# EAGLE design untitled (EAGLE 9.5.2)
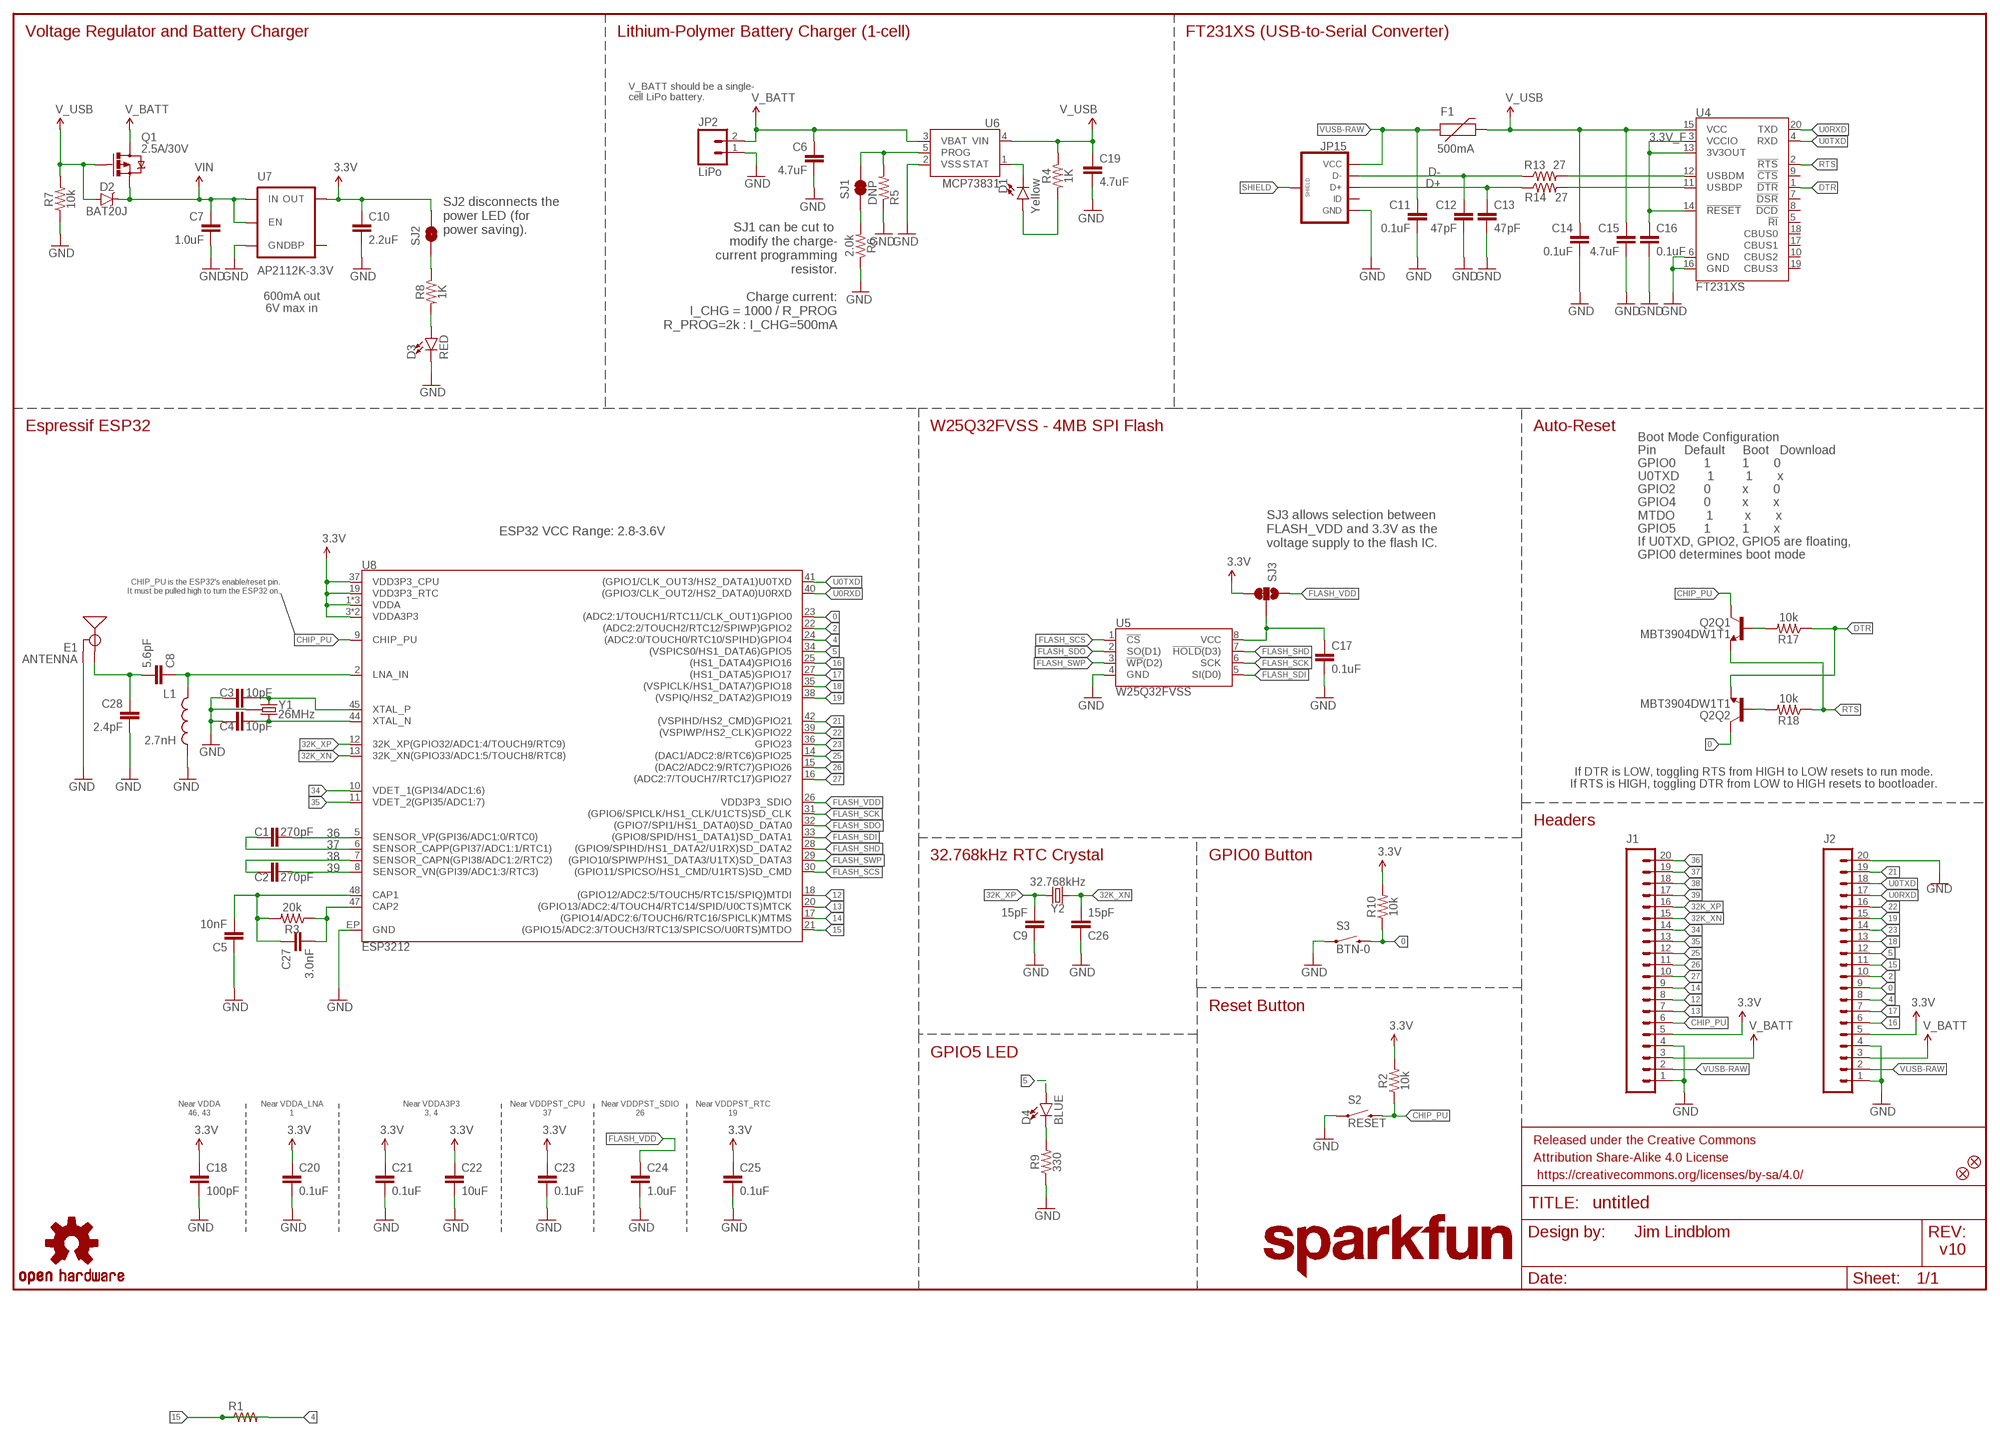
[diagram p0: schematic, sheet 1]

## Parts
C1  270pF  270PF-50V-5%(0603)  [0603]
C2  270pF  270PF-50V-5%(0603)  [0603]
C3  10pF  10PF-0603-50V-5%  [0603]
C4  10pF  10PF-0603-50V-5%  [0603]
C5  10nF  10NF-0603-50V-10%  [0603]
C6  4.7uF  4.7UF0603  [0603]
C7  1.0uF  1.0UF-0805-25V-(+80/-20%)  [0805]
C8  5.6pF  5.6PF-50V-5%(0603)  [0603]
C9  15pF  15PF-0603-50V-5%  [0603]
C10  2.2uF  2.2UF-0603-10V-20%  [0603]
C11  0.1uF  0.1UF-0603-25V-(+80/-20%)  [0603]
C12  47pF  47PF-0603-50V-5%  [0603]
C13  47pF  47PF-0603-50V-5%  [0603]
C14  0.1uF  0.1UF-0603-25V-(+80/-20%)  [0603]
C15  4.7uF  4.7UF-6.3V-10%(0603)0603  [0603-CAP]
C16  0.1uF  0.1UF-0603-25V-(+80/-20%)  [0603]
C17  0.1uF  0.1UF-0603-25V-(+80/-20%)  [0603]
C18  100pF  100PF-0603-50V-5%  [0603]
C19  4.7uF  4.7UF0603  [0603]
C20  0.1uF  0.1UF-0603-25V-(+80/-20%)  [0603]
C21  0.1uF  0.1UF-0603-25V-(+80/-20%)  [0603]
C22  10uF  10UF-0603-6.3V-20%  [0603]
C23  0.1uF  0.1UF-0603-25V-(+80/-20%)  [0603]
C24  1.0uF  1.0UF-0603-16V-10%  [0603]
C25  0.1uF  0.1UF-0603-25V-(+80/-20%)  [0603]
C26  15pF  15PF-0603-50V-5%  [0603]
C27  3.0nF  3.0NF-0603-50V-5%  [0603]
C28  2.4pF  2.4PF-0603-50V-5%  [0603]
D1  Yellow  LED-YELLOW0603  [LED-0603]
D2  BAT20J  DIODE-SCHOTTKY-BAT20J  [SOD-323]
D3  RED  LED-RED0603  [LED-0603]
D4  BLUE  LED-BLUE0603  [LED-0603]
E1  ANTENNA  ANTENNATRACE-TUNED  [TRACE_ANTENNA_2.4GHZ_25.7MM_TUNED]
F1  500mA  PTCSMD  [PTC-1206]
FD1  FIDUCIALUFIDUCIAL  [MICRO-FIDUCIAL]
FD2  FIDUCIALUFIDUCIAL  [MICRO-FIDUCIAL]
FRAME2  FRAME-LEDGER  [CREATIVE_COMMONS]
J1  M20NOSILK  [1X20_NOSILK]
J2  M20NOSILK  [1X20_NOSILK]
JP2  LiPo  M02JST-PTH-2  [JST-2-PTH]
JP15  USB_MICROB_PLUGCONN-11752  [USB-B-MICRO-SMD_V03]
L1  2.7nH  INDUCTOR0603  [0603]
LOGO1  SFE_LOGO_NAME.2_INCH  [SFE_LOGO_NAME_.2]
LOGO2  OSHW-LOGOMINI  [OSHW-LOGO-MINI]
LOGO3  SFE_LOGO_NAME.2_INCH  [SFE_LOGO_NAME_.2]
Q1  2.5A/30V  MOSFET-PCHANNELDMG2307L  [SOT23-3]
Q2  MBT3904DW1T1  [SC70-6]
R1  R-US_M0805  [M0805]
R2  10k  10KOHM-1/10W-1%(0603)0603  [0603]
R3  20k  20KOHM-0603-1/10W-1%  [0603]
R4  1K  1KOHM-1/10W-1%(0603)  [0603]
R5  DNP  RESISTORPTH-1/6W  [1/6W-RES]
R6  2.0k  2.0KOHM1/10W5%(0603)  [0603]
R7  10k  10KOHM-0603-1/10W-1%  [0603]
R8  1K  1KOHM-1/10W-1%(0603)  [0603]
R9  330  330OHM1/10W1%(0603)  [0603]
R10  10k  10KOHM-1/10W-1%(0603)0603  [0603]
R13  27  27OHM1/10W1%(0603)0603-RES  [0603]
R14  27  27OHM1/10W1%(0603)0603-RES  [0603]
R17  10k  10KOHM-0603-1/10W-1%  [0603]
R18  10k  10KOHM-0603-1/10W-1%  [0603]
S2  RESET  SWITCH-MOMENTARY-2SMD-4.6X2.8MM  [TACTILE_SWITCH_SMD_4.6X2.8MM]
S3  BTN-0  SWITCH-MOMENTARY-2SMD-4.6X2.8MM  [TACTILE_SWITCH_SMD_4.6X2.8MM]
SJ1  JUMPER-PAD-2-NC_BY_TRACE  [PAD-JUMPER-2-NC_BY_TRACE_YES_SILK]
SJ2  JUMPER-PAD-2-NC_BY_TRACE  [PAD-JUMPER-2-NC_BY_TRACE_YES_SILK]
SJ3  JUMPER-PAD-3-2OF3_NC_BY_TRACE_SMALL  [PAD-JUMPER-3-2OF3_NC_BY_TRACE_YES_SILK_FULL_BOX]
U4  FT231XS  [SSOP20_L]
U5  W25Q32FVSS  [SOIC-8]
U6  MCP73831  [SOT23-5]
U7  AP2112K-3.3V  V_REG_LDOSMD  [SOT23-5]
U8  ESP3212  [QFN48-0.4MM]
Y1  26MHz  CRYSTAL-GROUNDED3.2X2.5  [CRYSTAL-SMD-3.2X2.5]
Y2  32.768kHz  CRYSTAL-32.768KHZSMD-3.2X1.5  [CRYSTAL-SMD-3.2X1.5MM]

## Nets
0: J2.9 Q2.6(Q2:C) R10.1 S3.3 S3.4 U8.23((ADC2:1/TOUCH1/RTC11/CLK_OUT1)GPIO0)
2: J2.10 U8.22((ADC2:2/TOUCH2/RTC12/SPIWP)GPIO2)
3.3V: C10.1 C18.1 C20.1 C21.1 C22.1 C23.1 C25.1 J1.5 J2.5 R2.2 R10.2 SJ2.2 SJ3.3 U7.5(OUT) U8.1(VDDA) U8.3(VDDA3P3) U8.4(VDDA3P3) U8.19(VDD3P3_RTC) U8.37(VDD3P3_CPU) U8.43(VDDA) U8.46(VDDA)
3.3V_F: C16.1 U4.3(VCCIO) U4.13(3V3OUT) U4.14(!RESET)
4: J2.8 U8.24((ADC2:0/TOUCH0/RTC10/SPIHD)GPIO4)
5: D4.A J2.12 U8.34((VSPICS0/HS1_DATA6)GPIO5)
12: J1.8 U8.18((GPIO12/ADC2:5/TOUCH5/RTC15/SPIQ)MTDI)
13: J1.7 U8.20((GPIO13/ADC2:4/TOUCH4/RTC14/SPID/U0CTS)MTCK)
14: J1.9 U8.17((GPIO14/ADC2:6/TOUCH6/RTC16/SPICLK)MTMS)
15: J2.11 U8.21((GPIO15/ADC2:3/TOUCH3/RTC13/SPICSO/U0RTS)MTDO)
16: J2.6 U8.25((HS1_DATA4)GPIO16)
17: J2.7 U8.27((HS1_DATA5)GPIO17)
18: J2.13 U8.35((VSPICLK/HS1_DATA7)GPIO18)
19: J2.15 U8.38((VSPIQ/HS2_DATA2)GPIO19)
21: J2.19 U8.42((VSPIHD/HS2_CMD)GPIO21)
22: J2.16 U8.39((VSPIWP/HS2_CLK)GPIO22)
23: J2.14 U8.36(GPIO23)
25: J1.12 U8.14((DAC1/ADC2:8/RTC6)GPIO25)
26: J1.11 U8.15((DAC2/ADC2:9/RTC7)GPIO26)
27: J1.10 U8.16((ADC2:7/TOUCH7/RTC17)GPIO27)
32K_XN: C26.2 J1.15 U8.13(32K_XN(GPIO33/ADC1:5/TOUCH8/RTC8)) Y2.P$2
32K_XP: C9.2 J1.16 U8.12(32K_XP(GPIO32/ADC1:4/TOUCH9/RTC9)) Y2.P$1
34: J1.14 U8.10(VDET_1(GPI34/ADC1:6))
35: J1.13 U8.11(VDET_2(GPI35/ADC1:7))
36: C1.2 J1.20 U8.5(SENSOR_VP(GPI36/ADC1:0/RTC0))
37: C1.1 J1.19 U8.6(SENSOR_CAPP(GPI37/ADC1:1/RTC1))
38: C2.1 J1.18 U8.7(SENSOR_CAPN(GPI38/ADC1:2/RTC2))
39: C2.2 J1.17 U8.8(SENSOR_VN(GPI39/ADC1:3/RTC3))
CAP_10N: C5.2 C27.1 R3.2 U8.48(CAP1)
CHIP_PU: J1.6 Q2.3(Q1:C) R2.1 S2.3 S2.4 U8.9(CHIP_PU)
D+: C13.1 JP15.D+ R14.1
D-: C12.1 JP15.D- R13.1
DTR: Q2.1(Q2:E) R17.1 U4.1(!DTR)
FLASH_SCK: U5.6(SCK) U8.31((GPIO6/SPICLK/HS1_CLK/U1CTS)SD_CLK)
FLASH_SCS: U5.1(!CS!) U8.30((GPIO11/SPICSO/HS1_CMD/U1RTS)SD_CMD)
FLASH_SDI: U5.5(SI(D0)) U8.33((GPIO8/SPID/HS1_DATA1)SD_DATA1)
FLASH_SDO: U5.2(SO(D1)) U8.32((GPIO7/SPI1/HS1_DATA0)SD_DATA0)
FLASH_SHD: U5.7(!HOLD!(D3)) U8.28((GPIO9/SPIHD/HS1_DATA2/U1RX)SD_DATA2)
FLASH_SWP: U5.3(!WP!(D2)) U8.29((GPIO10/SPIWP/HS1_DATA3/U1TX)SD_DATA3)
FLASH_VDD: C24.1 SJ3.1 U8.26(VDD3P3_SDIO)
GND: C3.1 C4.1 C5.1 C6.2 C7.2 C9.1 C10.2 C11.2 C12.2 C13.2 C14.2 C15.2 C16.2 C17.2 C18.2 C19.2 C20.2 C21.2 C22.2 C23.2 C24.2 C25.2 C26.1 C28.2 D3.C E1.GND E1.GND2(GND) J1.1 J1.4 J2.1 J2.4 J2.20 JP2.1 JP15.GND L1.2 R5.1 R6.1 R7.1 R9.1 S2.1 S2.2 S3.1 S3.2 U4.6(GND) U4.16(GND) U5.4(GND) U6.2(VSS) U7.2(GND) U8.EP(GND) Y1.2(GND) Y1.4(GND)
LNA_IN: C8.1 L1.1 U8.2(LNA_IN)
N$1: R1.1 R1.2
N$7: R13.2 U4.12(USBDM)
N$8: R14.2 U4.11(USBDP)
N$9: D1.C U6.1(STAT)
N$10: Q2.5(Q1:B) R17.2
N$11: C17.1 SJ3.2 U5.8(VCC)
N$12: Q2.2(Q2:B) R18.2
N$13: C3.2 U8.45(XTAL_P) Y1.1
N$14: R5.2 SJ1.2 U6.5(PROG)
N$15: C4.2 U8.44(XTAL_N) Y1.3
N$16: R6.2 SJ1.1
N$17: D1.A R4.2
N$18: D3.A R8.2
N$19: R8.1 SJ2.1
N$20: D4.C R9.2
N$21: C27.2 R3.1 U8.47(CAP2)
RTS: Q2.4(Q1:E) R18.1 U4.2(!RTS)
SHIELD: JP15.SHIELD1(SHIELD) JP15.SHIELD2(SHIELD) JP15.SHIELD3(SHIELD)
TRACE_ANT: C8.2 C28.1 E1.ANT(SIGNAL)
U0RXD: J2.17 U4.20(TXD) U8.40((GPIO3/CLK_OUT2/HS2_DATA0)U0RXD)
U0TXD: J2.18 U4.4(RXD) U8.41((GPIO1/CLK_OUT3/HS2_DATA1)U0TXD)
V_BATT: C6.1 J1.3 J2.3 JP2.2 Q1.3(D) U6.3(VBAT)
V_USB: C14.1 C15.1 C19.1 D2.A F1.2 Q1.1(G) R4.1 R7.2 U4.15(VCC) U6.4(VIN)
VIN: C7.1 D2.C Q1.2(S) U7.1(IN) U7.3(EN)
VUSB-RAW: C11.1 F1.1 J1.2 J2.2 JP15.VBUS(VCC)
Unconnected: JP15.ID U4.5(!RI) U4.7(!DSR) U4.8(!DCD) U4.9(!CTS) U4.10(CBUS2) U4.17(CBUS1) U4.18(CBUS0) U4.19(CBUS3) U7.4(BP)

## Notes on the sheet
- Voltage Regulator and Battery Charger | Lithium-Polymer Battery Charger (1-cell) | FT231XS (USB-to-Serial Converter)
- V_BATT should be a single-
  cell LiPo battery.
- SJ1 can be cut to 
  modify the charge-
  current programming
  resistor.
- SJ2 disconnects the
  power LED (for 
  power saving).
- 600mA out
  6V max in
- Charge current:
  I_CHG = 1000 / R_PROG
  R_PROG=2k : I_CHG=500mA
- Espressif ESP32 | W25Q32FVSS - 4MB SPI Flash | Auto-Reset
- ESP32 VCC Range: 2.8-3.6V
- SJ3 allows selection between 
  FLASH_VDD and 3.3V as the
  voltage supply to the flash IC.
- Boot Mode Configuration
  Pin        Default     Boot   Download
  GPIO0        1         1       0
  U0TXD        1         1       x
  GPIO2        0         x       0
  GPIO4        0         x       x
  MTDO         1         x       x
  GPIO5        1         1       x
  If U0TXD, GPIO2, GPIO5 are floating, 
  GPIO0 determines boot mode
- CHIP_PU is the ESP32's enable/reset pin.
  It must be pulled high to turn the ESP32 on.
- If DTR is LOW, toggling RTS from HIGH to LOW resets to run mode.
  If RTS is HIGH, toggling DTR from LOW to HIGH resets to bootloader.
- Headers
- 32.768kHz RTC Crystal | GPIO0 Button
- Reset Button
- GPIO5 LED
- Near VDDA
  46, 43
- Near VDDA_LNA
  1
- Near VDDA3P3
  3, 4
- Near VDDPST_CPU
  37
- Near VDDPST_SDIO
  26
- Near VDDPST_RTC
  19
- Jim Lindblom
- v10

## Library data of the parts
C1 C2 = esp32-thing-temp:270PF-50V-5%(0603): CAP-13339; PROD_ID: CAP-13339
C3 C4 = SparkFun-Capacitors:10PF: 10pF ceramic capacitors A capacitor is a passive two-terminal electrical component used to store electrical energy temporarily in an electric field.; PROD_ID: CAP-11812
C5 = SparkFun-Capacitors:10NF: 0.01uF/10nF/10,000pF ceramic capacitors A capacitor is a passive two-terminal electrical component used to store electrical energy temporarily in an electric field. CAP-09321; PROD_ID: CAP-00867
C6 C19 = SparkFun-Capacitors:4.7UF: 4.7µF ceramic capacitors A capacitor is a passive two-terminal electrical component used to store electrical energy temporarily in an electric field.; PROD_ID: CAP-08280
C7 = SparkFun-Capacitors:1.0UF: 1µF ceramic capacitors A capacitor is a passive two-terminal electrical component used to store electrical energy temporarily in an electric field.; PROD_ID: CAP-11625
C8 = esp32-thing-temp:5.6PF-50V-5%(0603): CAP-12456; PROD_ID: CAP-12456
C9 C26 = SparkFun-Capacitors:15PF: 15pF ceramic capacitors A capacitor is a passive two-terminal electrical component used to store electrical energy temporarily in an electric field.; PROD_ID: CAP-07881
C10 = SparkFun-Capacitors:2.2UF: 2.2µF ceramic capacitors A capacitor is a passive two-terminal electrical component used to store electrical energy temporarily in an electric field.; PROD_ID: CAP-07888
C11 C14 C16 C17 C20 C21 C23 C25 = SparkFun-Capacitors:0.1UF: 0.1µF ceramic capacitors A capacitor is a passive two-terminal electrical component used to store electrical energy temporarily in an electric field.; PROD_ID: CAP-00810
C12 C13 = SparkFun-Capacitors:47PF: 47pF ceramic capacitors A capacitor is a passive two-terminal electrical component used to store electrical energy temporarily in an electric field.; PROD_ID: CAP-08913
C15 = SparkFun-Capacitors:4.7UF-6.3V-10%(0603): CAP-08280; PROD_ID: CAP-08280
C18 = SparkFun-Capacitors:100PF: 100pF/0.1nF ceramic capacitors A capacitor is a passive two-terminal electrical component used to store electrical energy temporarily in an electric field.; PROD_ID: CAP-07883
C22 = SparkFun-Capacitors:10UF: 10.0µF ceramic capacitors A capacitor is a passive two-terminal electrical component used to store electrical energy temporarily in an electric field.; PROD_ID: CAP-11015
C24 = SparkFun-Capacitors:1.0UF: 1µF ceramic capacitors A capacitor is a passive two-terminal electrical component used to store electrical energy temporarily in an electric field.; PROD_ID: CAP-00868
C27 = esp32-thing-temp:3.0NF: 3.0nF (3nF, 3000pF) ceramic capacitors A capacitor is a passive two-terminal electrical component used to store electrical energy temporarily in an electric field.; PROD_ID: CAP-13515
C28 = esp32-thing-temp:2.4PF: 2.4pF ceramic capacitors A capacitor is a passive two-terminal electrical component used to store electrical energy temporarily in an electric field.; PROD_ID: CAP-13541
D1 = SparkFun-LED:LED-YELLOW: Yellow SMD LEDs LilyPad 1206- DIO-09909 0603- DIO-09003 "SMART" means more efficient and expensive; PROD_ID: DIO-09003
D2 = SparkFun-DiscreteSemi:DIODE-SCHOTTKY: Schottky diodes in SFE's production catalog BAT20J 1A 23V 0.62Vf RB751 120mA 40V 0.37Vf PMEG4005EJ 0.5A 40V 0.42Vf MBRA140 1A 40V 0.5Vf B340A 3A 40V SMA; PROD_ID: DIO-11623
D3 = SparkFun-LED:LED-RED: Red SMD LED Used in manufacturing of most products at SparkFun 0603 - SMD 0603 package Forward Voltage: 1.9V Forward Current: 20mA Datasheet: [Product Link] <http://docs.avagotech.com/docs/AV02-0551EN> 0603 SMART - SMD 0603 SMART package ( more efficient and expensive) Forward Voltage: 1.8V Forward Current: 20mA Datasheet: [Product Link] <http://www.osram-os.com/Graphics/XPic2/00077099_0.pdf> 1206 - SMD 1206 package Forward Voltage: 2V Forward Current: 20mA Datasheet: [Product Link] <https://www.sparkfun.com/datasheets/DevTools/LilyPad/Q150OVS4.pdff> 1206 LilyPad - SMD 1206 LilyPad package Forward Voltage: 2V Forward Current: 20mA Datasheet: [Product Link] <https://www.sparkfun.com/datasheets/DevTools/LilyPad/Q150OVS4.pdf>; PROD_ID: DIO-00819
D4 = SparkFun-LED:LED-BLUE: Blue SMD LED Used in manufacturing of various products at SparkFun 0603 - SMD 0603 package Manufacturer: Rohm Semiconductor Forward Voltage: 2.9V Forward Current: 5mA Wavelength: 470nm Digikey: [Product Link] <http://www.digikey.com/product-detail/en/SMLE12BC7TT86/511-1589-2-ND/1641808> 1206 - SMD1206 package Manufacturer:Lite-On Inc. Forward Voltage: 3.3V Forward Current: 20mA Wavelength: 468nm Digikey: [Product Link] <http://www.digikey.com/product-detail/en/lite-on-inc/LTST-C150TBKT/160-1643-1-ND/573584>; PROD_ID: DIO-08575
E1 = esp32-thing-temp:ANTENNA: Chip antenna Chip antenna with ground or secondary connection. Common with larger metal RF connectors.
F1 = SparkFun-PowerIC:PTC: Resettable Fuse PTC Resettable Fuse. Spark Fun Electronics SKU : COM-08357; PROD_ID: RES-11150
FD1 FD2 = SparkFun-Aesthetics:FIDUCIAL: Fiducial Alignment Points Various fiducial points for machine vision alignment.
FRAME2 = SparkFun-Aesthetics:FRAME-LEDGER: Schematic Frame Standard 11x14 US Ledger frame
J1 J2 = SparkFun-Connectors:M20: 1x20 .1" header This is just like the LOCK variant in that the holes are staggared by 5 mil, but except for the last two holes. They are not altered from the "standard" footprint layout. This is used for a special purpose on the layout of our Graphic LCD Backpack. Make sure you want to use this device before selecting it for you project!
JP2 = SparkFun-Connectors:M02: Standard 2-pin 0.1" header. Use with - straight break away headers ( PRT-00116) - right angle break away headers (PRT-00553) - swiss pins (PRT-00743) - machine pins (PRT-00117) - female headers (PRT-00115) Molex polarized connector foot print use with: PRT-08233 with associated crimp pins and housings. 2.54_SCREWTERM for use with PRT-10571. 3.5mm Screw Terminal footprints for PRT-08084 5mm Screw Terminal footprints for use with PRT-08432; PROD_ID: CONN-09863; SKU: PRT-09914
JP15 = SparkFun-Connectors:USB_MICROB_PLUG: USB Micro-B connectors Some male, some female. Watch your step!; PROD_ID: CONN-11752
L1 = SparkFun-Passives:INDUCTOR: Inductors Basic Inductor/Choke - 0603 and 1206. Footprints are not proven and vary greatly between part numbers. INDUCTOR POWER 3.3UH 4.0A SMD 0.197" L x 0.197" W x 0.177" H (5.00mm x 5.00mm x 4.50mm); PROD_ID: NDUC-08762
LOGO1 LOGO3 = SparkFun-Aesthetics:SFE_LOGO_NAME: SFE Logo, name only This is the SparkFun name logo. The logo on the schematic will always be the same size; the package variant is the height of the flame part of the logo (or the height the flame would be, if it were drawn). Default layer for the logo on the board is tSilk.
LOGO2 = SparkFun-Aesthetics:OSHW-LOGO: Open Source Hardware Logo This logo indicates the piece of hardware it is found on incorporates a OSHW license and/or adheres to the definition of open source hardware found here: http://freedomdefined.org/OSHW
Q1 = SparkFun-DiscreteSemi:MOSFET-PCHANNEL: Generic PMOSFET IRLML2244 - TRANS-11153 (SOT-23 -20V -4.3A) (1.Gate 2.Source 3.Drain) FQP27P06 - COM-10349 <http://www.sparkfun.com/products/10349> (TO-220 -60V -27A) (1.Gate 2.Source 3.Drain); PROD_ID: TRANS-11308
Q2 = esp32-thing-temp:MBT3904DW1T1: MBT3904DW1 Dual NPN Transistors The MBT3904W1 puts two general purpose 3904 NPN transistors in a single package. Datasheet <http://www.onsemi.com/pub_link/Collateral/MBT3904DW1T1-D.PDF>; PROD_ID: TRANS-13337
R1 = rcl:R-US_: RESISTOR, American symbol; SPICEPREFIX: R
R2 R10 = SparkFun-Resistors:10KOHM-1/10W-1%(0603): RES-00824; PROD_ID: RES-00824; VALUE: 10K
R3 = SparkFun-Resistors:20KOHM: 20kΩ resistor A resistor is a passive two-terminal electrical component that implements electrical resistance as a circuit element. Resistors act to reduce current flow, and, at the same time, act to lower voltage levels within circuits. - Wikipedia; PROD_ID: RES-09383
R4 R8 = SparkFun-Resistors:1KOHM-1/10W-1%(0603): RES-07856; PROD_ID: RES-07856
R5 = SparkFun-Passives:RESISTOR: Resistor Basic schematic elements and footprints for 0603, 1206, and PTH resistors.
R6 = SparkFun-Resistors:2.0KOHM1/10W5%(0603): RES-08296; PROD_ID: RES-08296
R7 R17 R18 = SparkFun-Resistors:10KOHM: 10kΩ resistor A resistor is a passive two-terminal electrical component that implements electrical resistance as a circuit element. Resistors act to reduce current flow, and, at the same time, act to lower voltage levels within circuits. - Wikipedia; PROD_ID: RES-00824
R9 = SparkFun-Resistors:330OHM1/10W1%(0603): RES-00818; PROD_ID: RES-00818
R13 R14 = SparkFun-Resistors:27OHM1/10W1%(0603): RES-09334; PROD_ID: RES-09334
S2 S3 = SparkFun-Electromechanical:SWITCH-MOMENTARY-2: Various NO switches- pushbuttons, reed, etc; PROD_ID: SWCH-13065
SJ1 SJ2 = SparkFun-Passives:JUMPER-PAD-2-NC_BY_TRACE
SJ3 = SparkFun-Passives:JUMPER-PAD-3-2OF3_NC_BY_TRACE
U4 = SparkFun-DigitalIC:FT231X: FTDI FT231X Full Speed USB to Full-handshake UART This USB2.0 Full Speed IC offers a compact bridge to full handshake UART interfaces. The device is a UART, capable of operating up to 3MBaud, with low power consumption (8mA). The FT231X includes the complete FT-X series feature set and enables USB to be added into a system design quickly and easily over a UART interface.; PROD_ID: IC-11524
U5 = SparkFun-DigitalIC:W25Q32FV: Winbond W25Q32FV 32Mbit (4MB) Flash The W25Q32FV support the standard Serial Peripheral Interface (SPI), Dual/Quad I/O SPI as well as 2-clocks instruction cycle Quad Peripheral Interface (QPI). Datasheet <http://www.winbond.com/resource-files/w25q32fv%20revh%20091613.pdf>; PROD_ID: IC-13229
U6 = SparkFun-PowerIC:MCP73831: Miniature single cell, fully integrated Li-Ion, Li-polymer charge management controller http://ww1.microchip.com/downloads/en/DeviceDoc/20001984g.pdf IC-09995; PROD_ID: IC-09995
U7 = SparkFun-PowerIC:V_REG_LDO: Voltage Regulator LDO Standard 150mA LDO voltage regulator in SOT-23 layout. Micrel part MIC5205. BP (by-pass) pin is used to lower output noise with 470pF cap.; PROD_ID: VREG-12457
U8 = esp32-thing-temp:ESP3212; PROD_ID: IC-13338
Y1 = things:CRYSTAL-GROUNDED; PROD_ID: XTAL-12454
Y2 = SparkFun-Clocks:CRYSTAL-32.768KHZ: 32.768kHz Crystal Frequency: 32.768kHz Frequency Stability: ±20ppm Load Capacitance: 12.5pF (PTH-2X6 & SMD-3.2X1.5), 6pF (SMD-2X6); PROD_ID: XTAL-13062

## Board
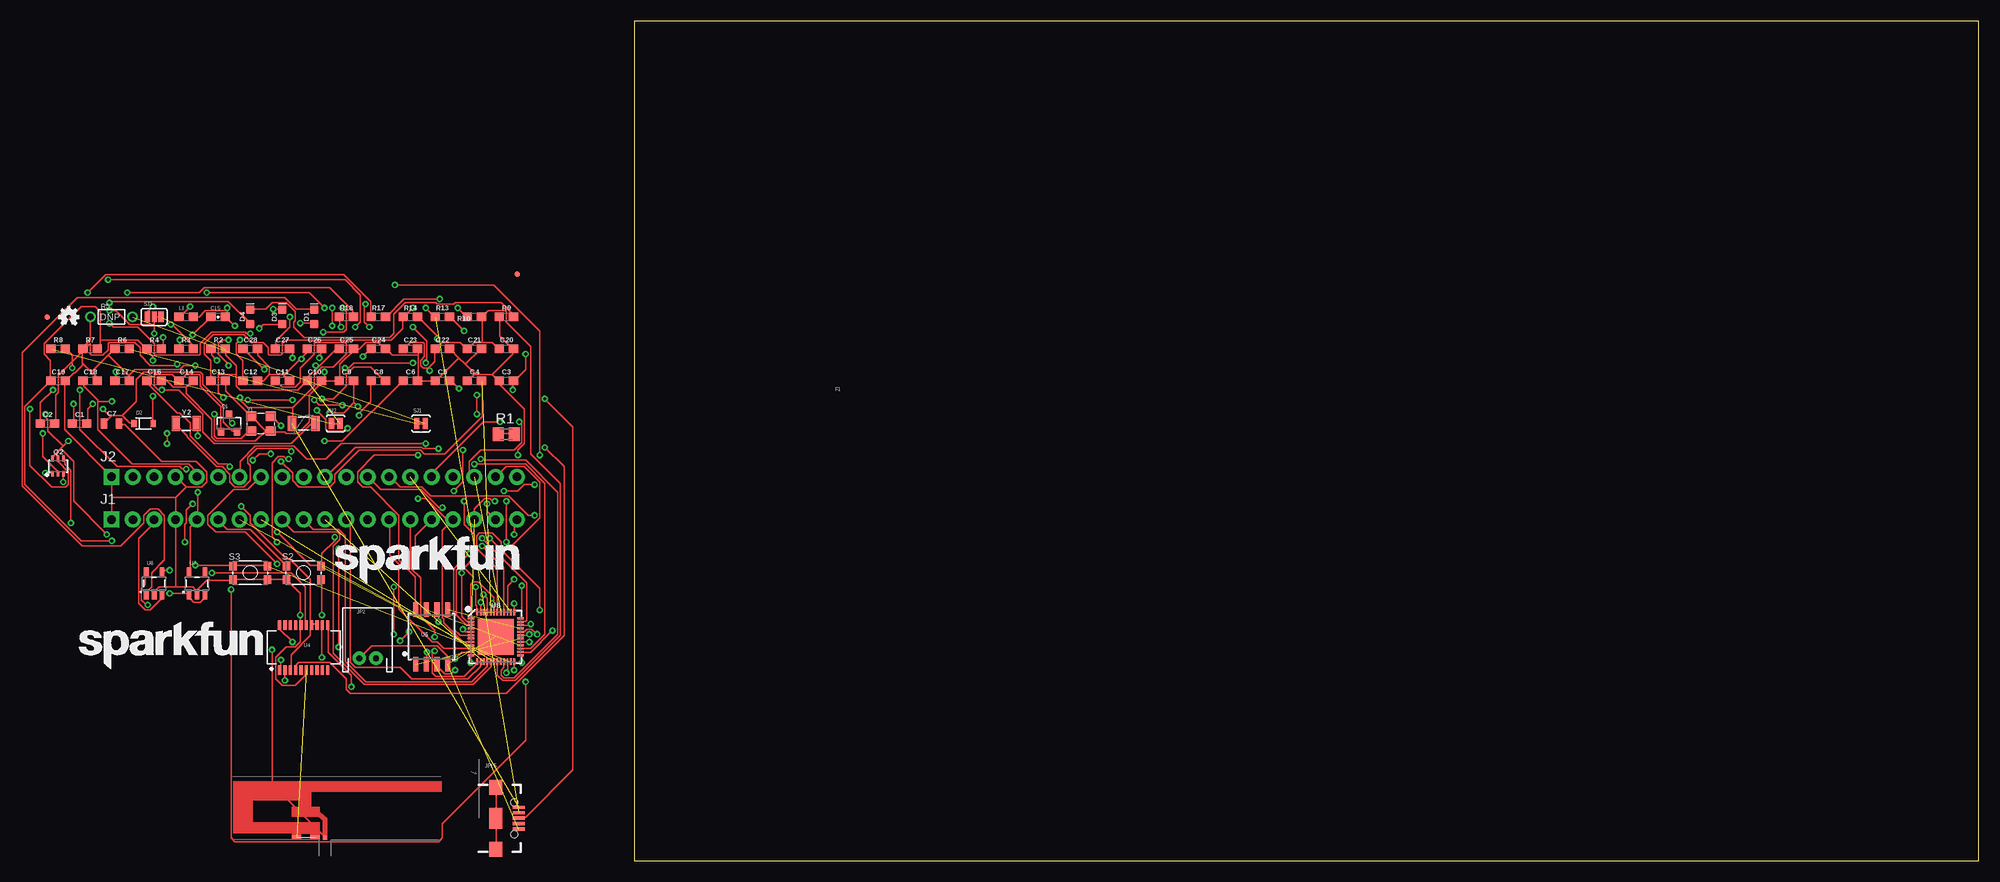
[diagram p1: board, top side]
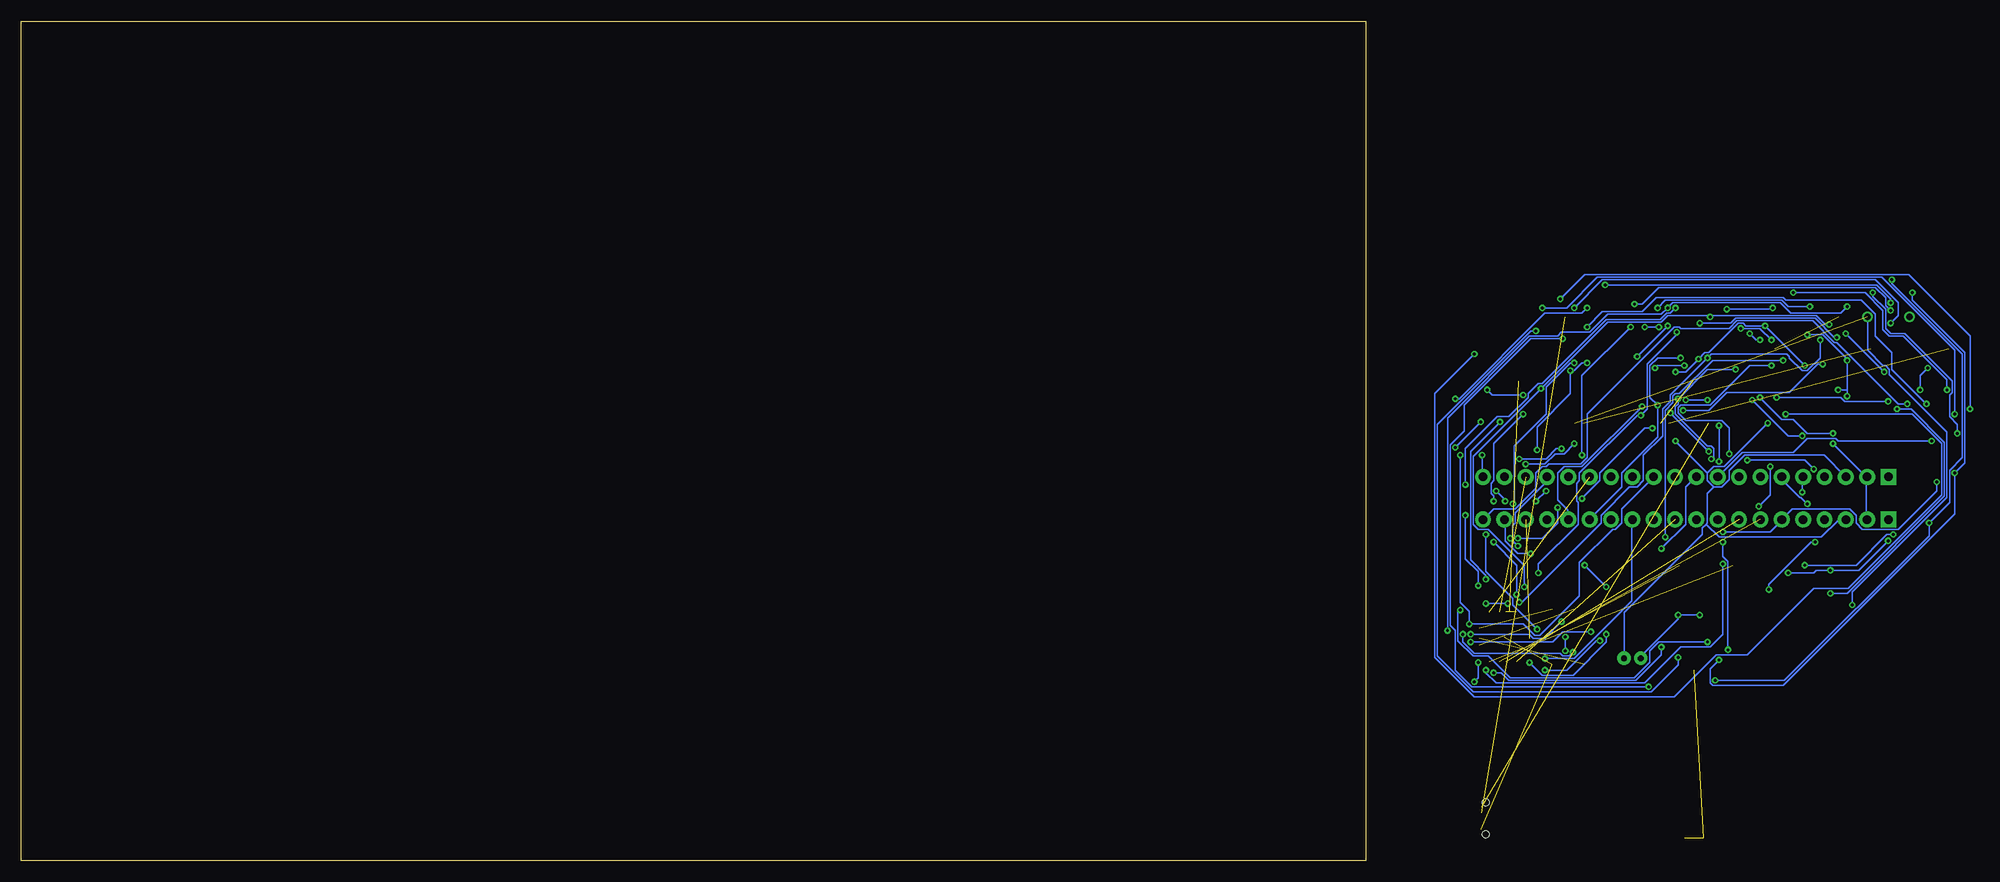
[diagram p2: board, bottom side, seen from below]

Size 160 x 100 mm. Coordinates in mm from the lower left corner, seen from the top.
Outline: 0,0 160,0 160,100 0,100 0,0
Copper layers (1*16): Top 0.035mm / dielectric 1.5mm / Bottom 0.035mm
Design rules "default": minimum track width 6mil, minimum drill 0.35mm, track to track 6mil, track to pad 6mil, pad to pad 6mil, via to via 6mil, smd to smd 6mil, copper to edge 40mil, drill to drill 6mil, minimum pad ring 10mil, minimum via ring 8mil, stop-mask expansion 4mil, vias tented up to drill 0mil, thermal gap 10mil

### Footprints (pad centres in the part's own frame; a part is rotated, then mirrored left to right if it is on the bottom)
0603 = smd 1.1 x 1: 1 -0.85,0; 2 0.85,0
0805 = smd 0.8 x 1.2: 1 -0.9,0; 2 0.9,0
0603-CAP = smd 1.1 x 1: 1 -0.85,0; 2 0.85,0
LED-0603 = smd 1 x 1: A 0,-0.877; C 0,0.877
SOD-323 = smd 0.63 x 0.83: A 1.15,0; C -1.15,0
TRACE_ANTENNA_2.4GHZ_25.7MM_TUNED = smd 0.46 x 0.46: ANT 0,0.23 | smd 1 x 0.46: GND -1.18,0.23; GND2 -3.38,0.23
PTC-1206 = smd 1 x 1.8: 1 -1.4,0; 2 1.4,0
MICRO-FIDUCIAL = smd 0.635 x 0.635: 1 0,0
1X20_NOSILK = drill 1.016 pad 1.88 square: 1 0,0 | drill 1.016 pad 1.88: 2 2.54,0; 3 5.08,0; 4 7.62,0; 5 10.16,0; 6 12.7,0; 7 15.24,0; 8 17.78,0; 9 20.32,0; 10 22.86,0; 11 25.4,0; 12 27.94,0; 13 30.48,0; 14 33.02,0; 15 35.56,0; 16 38.1,0; 17 40.64,0; 18 43.18,0; 19 45.72,0; 20 48.26,0
JST-2-PTH = drill 0.7 pad 1.6: 1 -1,0; 2 1,0
USB-B-MICRO-SMD_V03 = smd 1.45 x 0.4: D+ 2.725,0; D- 2.725,0.65; GND 2.725,-1.3; ID 2.725,-0.65; VBUS 2.725,1.3 | smd 1.5 x 1.8: SHIELD1 0,3.685; SHIELD2 0,-3.685 | smd 1.5 x 2.5: SHIELD3 0,0 | hole 0.85: 2.2,1.9; 2.2,-1.9
SOT23-3 = smd 0.8 x 0.9: 1 -0.95,-1; 2 0.95,-1; 3 0,1.1
SC70-6 = smd 0.3 x 0.66: 1 -0.65,-0.92; 2 0,-0.92; 3 0.65,-0.92; 4 0.65,0.92; 5 0,0.92; 6 -0.65,0.92
M0805 = smd 1.3 x 1.6: 1 -0.95,0; 2 0.95,0
1/6W-RES = drill 0.762: 1 -2.5,0; 2 2.5,0
TACTILE_SWITCH_SMD_4.6X2.8MM = smd 0.9 x 1: 1 -2.05,-0.8; 2 2.05,-0.8; 3 2.05,0.8; 4 -2.05,0.8
PAD-JUMPER-2-NC_BY_TRACE_YES_SILK = smd 0.635 x 1.27: 1 -0.508,0; 2 0.508,0
PAD-JUMPER-3-2OF3_NC_BY_TRACE_YES_SILK_FULL_BOX = smd 0.635 x 1.27: 1 -0.813,0; 2 0,0; 3 0.813,0
SSOP20_L = smd 0.381 x 1.143: 1 -2.857,-2.68; 2 -2.223,-2.68; 3 -1.587,-2.68; 4 -0.953,-2.68; 5 -0.318,-2.68; 6 0.318,-2.68; 7 0.953,-2.68; 8 1.587,-2.68; 9 2.223,-2.68; 10 2.857,-2.68; 11 2.857,2.68; 12 2.223,2.68; 13 1.587,2.68; 14 0.953,2.68; 15 0.318,2.68; 16 -0.318,2.68; 17 -0.953,2.68; 18 -1.587,2.68; 19 -2.223,2.68; 20 -2.857,2.68
SOIC-8 = smd 0.61 x 1.702: 1 -1.905,-3.251; 2 -0.635,-3.251; 3 0.635,-3.251; 4 1.905,-3.251; 5 1.905,3.251; 6 0.635,3.251; 7 -0.635,3.251; 8 -1.905,3.251
SOT23-5 = smd 0.55 x 1.2: 1 -0.95,-1.3; 2 0,-1.3; 3 0.95,-1.3; 4 0.95,1.3; 5 -0.95,1.3
QFN48-0.4MM = smd 0.8 x 0.23: 1 -2.95,2.2; 2 -2.95,1.8; 3 -2.95,1.4; 4 -2.95,1; 5 -2.95,0.6; 6 -2.95,0.2; 7 -2.95,-0.2; 8 -2.95,-0.6; 9 -2.95,-1; 10 -2.95,-1.4; 11 -2.95,-1.8; 12 -2.95,-2.2; 25 2.95,-2.2; 26 2.95,-1.8; 27 2.95,-1.4; 28 2.95,-1; 29 2.95,-0.6; 30 2.95,-0.2; 31 2.95,0.2; 32 2.95,0.6; 33 2.95,1; 34 2.95,1.4; 35 2.95,1.8; 36 2.95,2.2 | smd 0.23 x 0.8: 13 -2.2,-2.95; 14 -1.8,-2.95; 15 -1.4,-2.95; 16 -1,-2.95; 17 -0.6,-2.95; 18 -0.2,-2.95; 19 0.2,-2.95; 20 0.6,-2.95; 21 1,-2.95; 22 1.4,-2.95; 23 1.8,-2.95; 24 2.2,-2.95; 37 2.2,2.95; 38 1.8,2.95; 39 1.4,2.95; 40 1,2.95; 41 0.6,2.95; 42 0.2,2.95; 43 -0.2,2.95; 44 -0.6,2.95; 45 -1,2.95; 46 -1.4,2.95; 47 -1.8,2.95; 48 -2.2,2.95 | smd 4.3 x 4.3: EP 0,0
CRYSTAL-SMD-3.2X2.5 = smd 1.2 x 1.1: 1 -1.175,-0.875; 2 1.175,-0.875; 3 1.175,0.875; 4 -1.175,0.875
CRYSTAL-SMD-3.2X1.5MM = smd 1 x 1.8: P$1 -1.25,0; P$2 1.25,0

### Placement (x,y rotation side)
C1  -66.04,52.07 0 top  (outside the outline)
C2  -69.85,52.07 0 top  (outside the outline)
C3  -15.24,57.15 0 top  (outside the outline)
C4  -19.05,57.15 0 top  (outside the outline)
C5  -22.86,57.15 0 top  (outside the outline)
C6  -26.67,57.15 0 top  (outside the outline)
C7  -62.23,52.07 0 top  (outside the outline)
C8  -30.48,57.15 0 top  (outside the outline)
C9  -34.29,57.15 0 top  (outside the outline)
C10  -38.1,57.15 0 top  (outside the outline)
C11  -41.91,57.15 0 top  (outside the outline)
C12  -45.72,57.15 0 top  (outside the outline)
C13  -49.53,57.15 0 top  (outside the outline)
C14  -53.34,57.15 0 top  (outside the outline)
C15  -49.53,64.77 0 top  (outside the outline)
C16  -57.15,57.15 0 top  (outside the outline)
C17  -60.96,57.15 0 top  (outside the outline)
C18  -64.77,57.15 0 top  (outside the outline)
C19  -68.58,57.15 0 top  (outside the outline)
C20  -15.24,60.96 0 top  (outside the outline)
C21  -19.05,60.96 0 top  (outside the outline)
C22  -22.86,60.96 0 top  (outside the outline)
C23  -26.67,60.96 0 top  (outside the outline)
C24  -30.48,60.96 0 top  (outside the outline)
C25  -34.29,60.96 0 top  (outside the outline)
C26  -38.1,60.96 0 top  (outside the outline)
C27  -41.91,60.96 0 top  (outside the outline)
C28  -45.72,60.96 0 top  (outside the outline)
D1  -38.1,64.77 0 top  (outside the outline)
D2  -58.42,52.07 0 top  (outside the outline)
D3  -41.91,64.77 0 top  (outside the outline)
D4  -45.72,64.77 0 top  (outside the outline)
E1  -36.83,2.54 0 top  (outside the outline)
F1  -39.37,52.07 0 top  (outside the outline)
FD1  -69.85,64.77 0 top  (outside the outline)
FD2  -13.97,69.85 90 top  (outside the outline)
FRAME2  -80.01,13.97 0 top  (outside the outline)
J1  -62.23,40.64 0 top  (outside the outline)
J2  -62.23,45.72 0 top  (outside the outline)
JP2  -31.75,24.13 0 top  (outside the outline)
JP15  -16.51,5.08 0 top  (outside the outline)
L1  -53.34,64.77 0 top  (outside the outline)
LOGO1  -66.04,22.86 0 top  (outside the outline)
LOGO2  -67.31,64.77 0 top  (outside the outline)
LOGO3  -35.56,33.02 0 top  (outside the outline)
Q1  -48.26,52.07 0 top  (outside the outline)
Q2  -68.58,46.99 0 top  (outside the outline)
R1  -15.24,50.8 0 top  (outside the outline)
R2  -49.53,60.96 0 top  (outside the outline)
R3  -53.34,60.96 0 top  (outside the outline)
R4  -57.15,60.96 0 top  (outside the outline)
R5  -62.23,64.77 0 top  (outside the outline)
R6  -60.96,60.96 0 top  (outside the outline)
R7  -64.77,60.96 0 top  (outside the outline)
R8  -68.58,60.96 0 top  (outside the outline)
R9  -15.24,64.77 0 top  (outside the outline)
R10  -19.05,64.77 0 top  (outside the outline)
R13  -22.86,64.77 0 top  (outside the outline)
R14  -26.67,64.77 0 top  (outside the outline)
R17  -30.48,64.77 0 top  (outside the outline)
R18  -34.29,64.77 0 top  (outside the outline)
S2  -39.37,34.29 0 top  (outside the outline)
S3  -45.72,34.29 0 top  (outside the outline)
SJ1  -25.4,52.07 0 top  (outside the outline)
SJ2  -35.56,52.07 0 top  (outside the outline)
SJ3  -57.15,64.77 0 top  (outside the outline)
U4  -39.37,25.4 0 top  (outside the outline)
U5  -24.13,26.67 0 top  (outside the outline)
U6  -57.15,33.02 0 top  (outside the outline)
U7  -52.07,33.02 0 top  (outside the outline)
U8  -16.51,26.67 0 top  (outside the outline)
Y1  -44.45,52.07 0 top  (outside the outline)
Y2  -53.34,52.07 0 top  (outside the outline)

### Tracks (layer width: path | path; a pad name or v marks a point on that pad's centre or on a via)
0  (via drill 0.35)  (1 unrouted)
  Top 0.152: S3.3 -43.74,35.2 -47.7,35.2 S3.4 -47.85,35.2 v-52.27,35.2 | v-67.36,49.99 -67.97,49.38 | -67.97,49.38 -68.28,49.07 | -68.28,49.07 -69.19,48.16 -69.19,48.01 Q2.6 | v-21.03,65.84 -19.96,64.77 R10.1 | v-70.1,53.19 -70.1,52.88 -69.8,52.58 -69.8,51.21 -67.97,49.38 | v-62.79,38.86 -66.75,42.82 -66.75,47.55 -68.28,49.07
  Bottom 0.152: v-67.36,49.99 -56.24,49.99 -55.93,50.29 -52.58,50.29 -50.9,48.62 -44.81,48.62 J2.9 | v-21.03,65.84 -23.93,65.84 -27.58,69.49 -61.42,69.49 -70.1,60.81 v-70.1,53.19 | v-52.27,35.2 -58.37,35.2 -62.03,38.86 v-62.79,38.86
2  (via drill 0.35)
  Top 0.152: v-15.24,22.4 -15.09,22.55 -15.09,23.62 U8.22 | v-35.2,37.19 v-35.2,25.45
  Bottom 0.152: v-15.24,22.4 -16.15,22.4 -17.07,21.49 -32.16,21.49 -35.2,24.54 v-35.2,25.45 | v-35.2,37.19 -38.1,40.08 -38.1,44.5 -39.32,45.72 J2.10
3.3V  (via drill 0.35)  (3 unrouted)
  Top 0.152: -37.64,58.83 -35.51,60.96 C25.1 | -37.64,58.83 -38.86,57.61 -38.86,57.15 C10.1 -39.01,57.15 -40.08,56.08 -46.94,56.08 -47.4,56.54 -47.4,57.91 | -47.4,57.91 -47.4,58.98 -48.62,60.2 -48.62,60.96 R2.2 | U7.5 -52.88,34.44 -52.88,39.78 -52.12,40.54 J1.5 -51.97,40.69 v-51.97,43.89 | -63.86,54.71 -63.86,51.36 -59.74,47.24 -53.03,47.24 -52.12,46.33 -52.12,45.72 J2.5 | -63.86,54.71 -63.86,54.86 -65.53,56.54 -65.53,57.15 C18.1 | -47.4,57.91 -49.38,57.91 -49.53,57.76 -49.53,55.78 v-48.92,55.17 | -63.86,54.71 v-62.18,54.71 | -19.51,28.04 -19.51,27.74 U8.4 | -19.2,33.22 -19.51,32.92 -19.51,28.96 U8.1 | -19.2,33.22 -18.59,33.22 -16.76,31.39 -16.76,30.63 | -16.76,30.63 -16.76,29.72 U8.43 | v-14.33,30.63 -14.33,29.72 U8.37 | -16.76,30.63 v-16.92,30.63 | -19.51,28.04 -19.96,28.04 -21.18,29.26 -21.18,34.59 -20.88,34.9 -20.27,34.9 | -20.27,34.9 -19.2,33.83 -19.2,33.22 | -19.51,28.04 U8.3 | -24.69,58.67 -24.54,58.67 -23.77,59.44 -23.77,60.96 C22.1 -23.62,60.96 -22.86,61.72 -20.73,61.72 -19.96,60.96 C21.1 -19.81,60.96 -19.05,61.72 -18.14,61.72 | -24.69,58.67 -25.15,58.67 -25.45,58.98 -25.45,59.59 -24.99,60.05 -24.99,61.57 -25.15,61.72 -26.67,61.72 -27.43,60.96 C23.1 | -18.14,61.72 -16.92,61.72 -16.15,60.96 C20.1 | -18.14,64.77 -17.37,65.53 -15.39,65.53 -15.24,65.38 -15.24,64.16 -12.34,61.27 -12.34,48.46 -8.84,44.96 -8.84,26.82 -14.17,21.49 -15.7,21.49 -16.31,22.1 -16.31,23.62 U8.19 | -18.14,64.77 -18.14,61.72 | -18.14,64.77 R10.2 | -20.27,34.9 -19.05,36.12 -19.05,38.86 -20.27,40.08 v-20.27,42.82 | v-21.49,44.04 -20.42,45.11 v-20.42,48.92 | -24.69,58.67 v-24.38,58.37 | -37.64,58.83 -37.8,58.83 v-37.95,58.98
  Top 0.152: v-34.44,58.67 -33.98,58.67 -33.38,59.28 v-26.36,59.28
  Bottom 0.152: v-51.97,43.89 -51.97,45.72 J2.5 | v-48.92,55.17 -56.54,55.17 -57,54.71 v-62.18,54.71 | v-16.92,30.63 v-14.33,30.63 | v-21.49,44.04 v-20.27,42.82 | v-20.42,48.92 -20.42,51.66 -24.38,55.63 v-24.38,58.37 -24.84,58.37 -25.76,59.28 v-26.36,59.28 | v-37.95,58.98 -34.75,58.98 v-34.44,58.67
3.3V_F  (via drill 0.35)
  Top 0.152: v-48.16,46.94 -48.46,47.24 -49.53,47.24 -52.88,50.6 -52.88,52.12 -54.1,53.34 -54.41,53.34 -57.91,56.84 -57.91,57.15 C16.1 | v-46.79,42.22 -45.72,41.15 -45.72,40.23 -41.45,35.97 -41,35.97 -38.56,33.53 -38.56,28.19 U4.14 | U4.3 -40.84,22.86 -40.84,24.54 -38.56,26.82 -38.56,28.04 U4.14 | U4.13 -37.8,28.19 -38.41,28.19 U4.14
  Bottom 0.152: v-48.16,46.94 -48.16,43.59 v-46.79,42.22
4  (via drill 0.35)
  Top 0.152: v-14.33,22.71 -14.33,23.62 U8.24 | v-42.52,35.36 -46.33,39.17 -49.84,39.17 -50.75,40.08 -50.75,41.15 -47.7,44.2 -46.02,44.2 -44.5,45.72 J2.8
  Bottom 0.152: v-14.33,22.71 -14.33,22.4 -15.54,21.18 -33.22,21.18 -37.49,25.45 -41,25.45 -42.52,26.98 v-42.52,35.36
5  (via drill 0.35)
  Top 0.152: v-12.34,28.19 -12.5,28.04 -13.41,28.04 U8.34 | v-62.48,66.45 -62.33,66.6 -48.31,66.6 -45.72,64.01 D4.A | v-28.5,68.58 -16.76,68.58 -11.28,63.09 v-11.28,48.31
  Bottom 0.152: J2.12 -30.48,41.91 -30.48,40.23 -29.72,39.47 -29.41,39.47 -25.45,35.51 -25.45,31.55 -20.73,26.82 -20.12,26.82 -18.75,28.19 v-12.34,28.19 -12.34,29.72 -11.28,30.79 v-11.28,48.31 | v-62.48,66.45 -62.48,66.9 -60.81,68.58 v-28.5,68.58
12  (1 unrouted)
13  (1 unrouted)
14
  Top 0.152: U8.17 -17.07,23.62 -17.07,23.16 -19.2,21.03 -32.16,21.03 -35.81,24.69 -35.81,37.49 -35.05,38.25 -35.05,38.86 -35.36,39.17 -40.54,39.17 -41.91,40.54 J1.9
15  (via drill 0.35)
  Top 0.152: v-18.29,47.85 -18.14,47.7 -12.95,47.7 -9.14,43.89 -9.14,26.98 -14.33,21.79 -15.54,21.79 -15.85,22.1 -15.85,22.71 -15.54,23.01 -15.54,23.62 U8.21 | v-23.32,49.07 -25.15,49.07 -25.3,49.23 -33.22,49.23 -36.73,45.72 J2.11
  Bottom 0.152: v-18.29,47.85 -21.49,47.85 -22.71,49.07 v-23.32,49.07
16  (via drill 0.35)
  Top 0.152: v-13.41,23.62 -13.41,24.38 U8.25 | v-12.95,21.34 -12.95,14.33 -22.86,4.42 -22.86,2.74 -23.32,2.29 -47.55,2.29 -48.01,2.74 v-48.01,32.31 | v-53.49,37.95 -53.49,40.08 -53.34,40.23 -53.34,41.76 v-52.58,42.52
  Bottom 0.152: v-13.41,23.62 -13.41,21.79 v-12.95,21.34 | v-48.01,32.31 -48.01,32.92 -53.03,37.95 v-53.49,37.95 | v-52.58,42.52 -51.82,43.28 -51.66,43.28 -49.53,45.41 J2.6
17  (via drill 0.35)
  Top 0.152: v-19.05,47.24 -12.95,47.24 -10.67,44.96 -10.67,26.98 -12.34,25.3 -13.41,25.3 U8.27 | v-24.84,49.68 -34.9,49.68 -36.73,47.85 -39.01,47.85 -40.54,49.38 -45.11,49.38 -46.94,47.55 -46.94,45.72 J2.7
  Bottom 0.152: v-19.05,47.24 -21.34,47.24 -22.55,48.46 -23.62,48.46 v-24.84,49.68
18  (via drill 0.35)
  Top 0.152: v-18.14,38.41 -12.8,33.07 -12.8,28.65 -12.95,28.5 -13.41,28.5 U8.35 | v-22.86,42.06 -23.32,42.06 -25.45,44.2 -30.18,44.2 -31.7,45.72 J2.13
  Bottom 0.152: v-18.14,38.41 -21.03,38.41 -22.86,40.23 v-22.86,42.06
19  (1 unrouted)
21
  Top 0.152: U8.42 -16.31,29.72 -16.31,34.75 -18.75,37.19 -18.75,38.71 -18.44,39.01 -16.92,39.01 -15.85,37.95 -15.85,37.64 -15.54,37.34 -14.78,37.34 -11.28,40.84 -11.28,45.11 -13.11,46.94 -15.24,46.94 -16.46,45.72 J2.19
22  (via drill 0.35)
  Top 0.152: v-14.33,33.53 -15.09,32.77 -15.09,29.72 U8.39 | v-16,52.27 -17.98,52.27 -24.08,46.18 -24.08,45.72 J2.16
  Bottom 0.152: v-14.33,33.53 -14.33,33.98 -12.5,35.81 -12.5,48.77 v-16,52.27
23  (via drill 0.35)
  Top 0.152: v-13.41,32.77 -13.41,28.96 U8.36 | v-11.89,41.15 -12.65,41.15 -14.94,43.43 -24.23,43.43 -25.3,44.5 -27.89,44.5 -29.11,45.72 J2.14
  Bottom 0.152: v-13.41,32.77 -13.41,34.44 -11.89,35.97 v-11.89,41.15
25
  Top 0.152: U8.14 -18.29,23.62 -18.29,23.16 -19.81,21.64 -26.52,21.64 -27.89,23.01 -33.22,23.01 -33.83,23.62 -33.83,40.08 -34.29,40.54 J1.12
26  (1 unrouted)
27
  Top 0.152: U8.16 -17.53,23.62 -17.53,23.16 -19.36,21.34 -32,21.34 -34.44,23.77 -34.44,38.71 -35.2,39.47 -38.25,39.47 -39.32,40.54 J1.10
32K_XN  (via drill 0.35)
  Top 0.152: v-23.77,24.99 -24.08,24.69 -24.08,22.4 -23.62,21.95 -20.27,21.95 -18.75,23.47 -18.75,23.62 U8.13 | v-23.77,26.67 -23.77,27.43 -25.45,29.11 -25.45,33.68 -26.67,34.9 J1.15 | v-37.49,59.89 -37.34,60.05 -37.34,60.96 C26.2 | v-51.97,50.6 -51.97,51.97 Y2.P$2 | v-40.69,54.86 v-46.02,54.86 | v-38.1,54.86 -37.49,54.25 v-34.75,54.25
  Bottom 0.152: v-23.77,26.67 v-23.77,24.99 | v-37.49,59.89 -34.75,59.89 -33.83,58.98 -33.83,55.17 v-34.75,54.25 -34.75,50.44 -30.48,46.18 -30.48,44.5 -26.67,40.69 J1.15 | v-51.97,50.6 -50.29,50.6 v-46.02,54.86 | v-38.1,54.86 v-40.69,54.86
32K_XP  (via drill 0.35)
  Top 0.152: v-19.51,23.62 -19.51,24.38 U8.12 | v-28.65,32.61 v-28.65,26.98 | v-26.06,35.2 -26.06,38.71 J1.16 | -33.38,54.56 -33.38,57.15 C9.2 | v-32.92,54.1 -33.38,54.56 | v-40.84,48.77 -41.15,49.07 -44.96,49.07 -46.02,48.01 -46.02,47.4 -45.72,47.09 -45.72,45.26 -46.48,44.5 -47.55,44.5 -48.16,45.11 -48.16,46.02 -49.07,46.94 -49.68,46.94 -53.19,50.44 -53.19,50.6 -54.56,51.97 Y2.P$1 | v-36.27,53.34 -34.59,53.34 -33.38,54.56
  Bottom 0.152: v-19.51,23.62 -21.03,22.1 -24.69,22.1 -28.65,26.06 v-28.65,26.98 | v-26.06,35.2 v-28.65,32.61 | v-32.92,54.1 -25.76,46.94 -23.62,46.94 -22.86,46.18 -22.86,42.98 -24.08,41.76 -24.08,40.69 J1.16 | v-36.27,53.34 v-40.84,48.77
34
  Top 0.152: U8.10 -19.51,25.3 -22.71,25.3 -23.47,26.06 -24.08,26.06 -28.04,30.02 -28.04,35.36 -29.11,36.42 -29.11,40.54 J1.14
35  (via drill 0.35)
  Top 0.152: v-21.34,24.08 -20.57,24.84 -19.51,24.84 U8.11
  Bottom 0.152: v-21.34,24.08 -24.84,24.08 -31.7,30.94 -31.7,40.54 J1.13
36  (via drill 0.35)
  Top 0.152: v-20.42,27.58 -20.12,27.28 -19.51,27.28 U8.5 | v-14.33,38.86 -14.33,40.23 -14.02,40.54 J1.20 | v-64.47,54.41 -65.08,53.8 -65.08,52.12 C1.2
  Bottom 0.152: v-20.42,27.58 -17.53,30.48 -17.53,31.24 -14.33,34.44 v-14.33,38.86 | v-64.47,54.41 -63.4,54.41 -56.08,61.72 -55.78,61.72 -53.19,64.31 -44.2,64.31 -43.28,63.4 -37.49,63.4 -37.34,63.55 -36.73,63.55 -26.36,53.19 -26.36,48.01 -25.6,47.24 -21.79,47.24 -21.49,46.94 -21.03,46.94 -20.27,46.18 -20.27,44.35 -17.83,41.91 -15.24,41.91 J1.20
37  (via drill 0.35)
  Top 0.152: v-19.66,36.58 -21.49,34.75 -21.49,27.58 -20.73,26.82 -19.51,26.82 U8.6 | v-66.75,54.41 -66.75,52.12 C1.1 | v-26.36,63.55 -24.69,61.87 -24.69,59.44 v-24.84,59.28 | v-17.53,42.52 -17.53,41.6 -16.61,40.69 J1.19
  Bottom 0.152: v-19.66,36.58 -18.14,36.58 -16.61,38.1 -16.61,40.54 J1.19 | v-66.75,54.41 -62.64,58.52 -62.64,60.5 -60.66,62.48 -60.66,65.08 -58.98,66.75 -49.99,66.75 -49.68,67.06 -34.59,67.06 -32.92,65.38 -28.19,65.38 v-26.36,63.55 | v-24.84,59.28 -24.38,59.28 -21.49,56.39 -21.49,53.19 -17.68,49.38 -17.68,42.67 v-17.53,42.52
38  (via drill 0.35)  (1 unrouted)
  Top 0.152: v-69.19,56.08 -70.71,54.56 -70.71,52.12 C2.1 | v-50.9,67.67 -38.71,67.67 v-36.88,65.84 | v-11.89,44.81 -13.11,44.81 -13.87,44.04 v-15.54,44.04 | v-16.61,42.82 -16.92,42.82 -17.22,43.13 -17.83,43.13 -19.05,41.91 J1.18
  Bottom 0.152: v-69.19,56.08 -69.19,57.3 -64.01,62.48 -62.33,62.48 -61.57,63.25 -61.57,65.53 -59.44,67.67 v-50.9,67.67 | v-36.88,65.84 -36.27,65.23 -35.81,65.23 -35.05,64.47 -28.65,64.47 -21.03,56.84 -20.57,56.84 -19.36,55.63 -19.36,55.17 -17.07,52.88 -15.7,52.88 -11.89,49.07 v-11.89,44.81 | v-15.54,44.04 -16.61,42.98 v-16.61,42.82
39  (via drill 0.35)
  Top 0.152: -21.95,40.23 -21.64,40.54 J1.17 -21.95,40.23 | -21.95,40.23 -22.86,39.32 -22.86,28.96 -22.71,28.8 -22.71,28.35 -20.42,26.06 -19.51,26.06 U8.8 | v-54.41,59.13 -54.56,58.98 -57.61,58.98 -58.83,60.2 -58.83,61.11 -59.44,61.72 -62.48,61.72 -62.64,61.57 -62.64,60.81 -63.25,60.2 -64.62,60.2 -64.77,60.35 -64.77,61.57 -68.58,57.76 -68.58,55.78 -68.89,55.47 -68.89,52.12 C2.2 | v-37.8,53.65 -36.73,52.58 -36.73,51.36 -36.58,51.21 -34.44,51.21 v-34.14,51.51 | v-25.76,43.13 -24.84,43.13 -21.95,40.23
  Bottom 0.152: v-54.41,59.13 -53.8,59.13 -50.44,55.78 -42.98,55.78 -40.84,53.65 v-37.8,53.65 | v-34.14,51.51 -33.22,51.51 -27.89,46.18 -27.89,45.26 v-25.76,43.13
CAP_10N  (via drill 0.35)
  Top 0.152: v-18.9,32.61 -18.9,30.48 -18.75,30.33 -18.75,29.72 U8.48 | v-20.88,56.24 -21.79,57.15 C5.2 | v-55.17,63.86 -55.02,63.86 -52.58,61.42 -52.58,60.96 R3.2 | v-41,64.77 -41,63.55 -42.67,61.87 -42.67,60.96 C27.1
  Bottom 0.152: v-18.9,32.61 -18.9,35.2 -14.63,39.47 -13.41,39.47 -12.8,40.08 -12.8,48.16 v-20.88,56.24 -28.8,64.16 -35.2,64.16 -35.97,64.92 -41,64.92 | v-55.17,63.86 -54.71,63.86 -53.65,64.92 -41,64.92 | -41,64.92 v-41,64.77
CHIP_PU  (via drill 0.35)  (1 unrouted)
  Top 0.152: v-67.97,45.11 -67.97,46.02 Q2.3 | S2.4 -41.45,35.2 -45.72,39.47 -48.46,39.47 -49.53,40.54 J1.6 | v-42.52,39.17 -38.56,35.2 -37.34,35.2 S2.3 -37.19,35.2 -37.19,36.58 -35.66,38.1 v-35.66,38.56 | v-49.68,59.59 -50.29,60.2 -50.29,60.96 R2.1
  Bottom 0.152: v-67.97,45.11 -67.97,44.04 -63.4,39.47 -59.13,39.47 -58.37,40.23 -58.37,41.15 -57.61,41.91 -50.75,41.91 -49.53,40.69 J1.6 -49.53,40.54 -48.16,39.17 v-42.52,39.17 | v-49.68,59.59 -41.3,59.59 -37.34,55.63 -36.88,55.63 -36.58,55.32 -36.58,54.56 -35.66,53.65 v-35.66,38.56
D+  (via drill 0.35)
  Top 0.152: C13.1 -50.44,57.15 -50.44,59.59 -51.21,60.35 -51.21,61.57 -50.14,62.64 -46.48,62.64 -45.57,61.72 -44.2,61.72 -43.59,61.11 -43.59,60.35 -43.43,60.2 -42.06,60.2 -41.91,60.35 -41.91,61.57 -41.45,62.03 -28.96,62.03 -27.58,63.4 -27.58,64.77 R14.1 -27.43,64.77 v-26.36,65.84 | v-10.67,55.02 -7.32,51.66 -7.32,10.82 -12.95,5.18 -13.72,5.18 JP15.D+
  Bottom 0.152: v-10.67,55.02 -11.12,55.02 -21.34,65.23 -25.76,65.23 v-26.36,65.84
D-  (via drill 0.35)  (1 unrouted)
  Top 0.152: v-46.94,62.03 -47.4,61.57 -47.4,60.35 -46.63,59.59 -46.63,57.15 C12.1 | v-45.72,62.79 -46.18,62.79 -46.33,62.94 -50.29,62.94 -51.66,61.57 -51.66,60.35 -51.82,60.2 -57,60.2 -57.15,60.35 -57.15,61.57 -59.13,63.55 -62.03,63.55 v-62.48,64.01 | v-24.84,65.84 -23.77,64.77 R13.1
  Bottom 0.152: v-46.94,62.03 -46.48,62.03 v-45.72,62.79 | v-62.48,64.01 -63.4,64.92 -63.4,66.45 -60.66,69.19 -28.19,69.19 v-24.84,65.84
DTR  (via drill 0.35)
  Top 0.152: v-70.1,46.18 -69.34,46.18 Q2.1 | v-42.06,23.93 -42.06,23.01 -42.22,22.86 U4.1 | v-65.08,67.67 -62.94,69.8 -34.59,69.8 -31.39,66.6 -31.39,64.77 R17.1
  Bottom 0.152: v-42.06,23.93 -41,22.86 -41,21.18 -41.3,20.88 -49.68,20.88 -70.1,41.3 v-70.1,46.18 -71.32,47.4 -71.32,60.5 -65.08,66.75 v-65.08,67.67
FLASH_SCK  (via drill 0.35)
  Top 0.152: v-12.5,26.98 -12.65,26.82 -13.41,26.82 U8.31 | v-23.32,28.5 -23.32,29.72 -23.47,29.87 U5.6
  Bottom 0.152: v-12.5,26.98 -19.51,26.98 -19.96,26.52 -21.34,26.52 v-23.32,28.5
FLASH_SCS  (1 unrouted)
FLASH_SDI  (1 unrouted)
FLASH_SDO  (via drill 0.35)
  Top 0.152: v-11.58,26.98 -12.19,27.58 -12.8,27.58 -13.11,27.28 -13.41,27.28 U8.32 | v-24.69,24.84 -24.69,23.47 U5.2
  Bottom 0.152: v-11.58,26.98 -11.58,26.06 -12.95,24.69 -23.16,24.69 -23.47,24.38 -24.23,24.38 v-24.69,24.84
FLASH_SHD  (1 unrouted)
FLASH_SWP  (via drill 0.35)
  Top 0.152: v-12.5,26.06 -13.41,26.06 U8.29 | v-27.89,26.21 v-26.82,27.28 | v-21.34,22.71 -21.79,22.25 -22.55,22.25 -23.62,23.32 U5.3
  Bottom 0.152: v-12.5,26.06 -22.25,26.06 -23.47,27.28 v-26.82,27.28 | v-27.89,26.21 -27.43,26.21 -23.93,22.71 v-21.34,22.71
FLASH_VDD  (via drill 0.35)
  Top 0.152: v-9.75,27.43 -12.34,24.84 -13.41,24.84 U8.26 | v-57.3,65.99 -57.91,65.38 -57.91,64.77 SJ3.1 | v-32.31,60.05 -31.39,60.96 C24.1 | v-35.97,65.84 v-35.97,63.7
  Bottom 0.152: v-9.75,27.43 -9.75,52.73 -19.51,62.48 -22.86,62.48 -23.32,62.94 -26.67,62.94 -28.8,65.08 -35.2,65.08 v-35.97,65.84 -36.58,66.45 -49.38,66.45 -50.6,65.23 -56.54,65.23 v-57.3,65.99 | v-35.97,63.7 v-32.31,60.05
GND  (via drill 0.35)  (4 unrouted)
  Top 0.152: -25.76,57.15 C5.1 -23.62,57.15 -20.88,59.89 | -25.76,57.15 -25.76,60.2 | -25.76,60.2 -25.76,60.96 C23.2 | -25.76,57.15 C6.2 | -16.92,57.91 -18.9,57.91 | -18.9,57.91 -19.05,57.91 -19.81,57.15 C4.1 | -16.92,57.91 -16.15,57.15 C3.1 -16,57.15 -16,56.69 -13.11,53.8 -13.11,49.68 -13.87,48.92 v-13.87,48.31 | -18.9,57.91 -20.12,59.13 | -20.12,59.13 -20.88,59.89 | -20.88,59.89 -21.95,60.96 C22.2 | -20.12,59.13 -18.29,60.96 C21.2 | -14.48,60.96 -14.48,60.35 -16.92,57.91 | -14.48,60.96 -16,62.48 -16,64.77 R9.1 | -14.48,60.96 C20.2 | C16.2 -55.63,57.15 -54.86,56.39 -53.34,56.39 | -53.34,56.39 -52.58,57.15 C14.2 | C13.2 -48.62,57.15 -48.62,55.93 -45.72,53.03 Y1.4 -45.57,52.88 -43.89,51.21 | -43.89,51.21 Y1.2 -43.13,51.05 -41.6,51.05 -41.45,50.9 -40.08,50.9 -38.71,52.27 -38.71,55.47 -37.03,57.15 | -53.34,56.39 -53.34,55.63 -50.29,52.58 -50.29,50.44 -49.84,49.99 -45.11,49.99 -43.89,51.21 | v-42.98,65.68 -41.91,65.68 D3.C | -48.46,65.53 -48.46,64.92 -48.62,64.77 | L1.2 -51.82,64.77 -51.05,65.53 -48.46,65.53 | -48.46,65.53 v-48.46,65.84 | C12.2 -44.2,57.15 -43.43,57.91 | -43.43,57.91 -41.91,57.91 -41.76,57.76 | -41.76,57.76 -41.15,57.15 C11.2 | -43.43,57.91 -43.43,58.83 -44.81,60.2 -44.81,60.96 C28.2 | -41.76,57.76 -39.78,59.74 | -39.78,59.74 -39.01,60.5 -39.01,60.96 C26.1 | -36.88,57.15 C9.1 -35.05,57.15 -35.05,59.13 -33.22,60.96 | -37.03,57.15 C10.2 | -33.22,60.96 -32.77,60.96 -32,61.72 -30.48,61.72 -29.72,60.96 C24.2 -29.57,60.96 -28.8,60.2 -25.76,60.2 | -33.22,60.96 C25.2 -33.38,60.96 | v-39.62,59.74 -39.78,59.74 | -36.88,57.15 v-36.88,58.22 | -36.88,57.15 -37.03,57.15 | v-47.55,63.7 -48.62,64.77
  Top 0.152: -48.62,64.77 C15.2 | -65.68,59.28 -65.68,60.96 R7.1 -65.53,60.96 -65.53,61.27 -64.77,62.03 -64.77,64.77 R5.1 | -65.68,59.28 -65.68,58.98 -66.6,58.06 -66.75,58.06 -67.67,57.15 C19.2 -67.82,57.15 -67.82,51.36 -62.18,45.72 | -65.68,59.28 -64.62,58.22 | -64.62,58.22 -64.01,57.61 -64.01,57.15 C18.2 | -64.62,58.22 -62.64,60.2 | -62.64,60.2 -61.87,60.96 R6.1 | -60.2,57.76 -60.2,57.15 C17.2 | -62.64,60.2 -60.2,57.76 | -62.18,45.72 -62.18,43.28 | -62.18,43.28 -62.18,40.69 J1.1 | -53.34,44.5 -51.51,44.5 -50.9,45.11 -50.9,46.33 -52.12,47.55 -56.24,47.55 -60.66,51.97 -61.27,51.97 C7.2 | -53.34,44.5 -54.56,45.72 J2.4 | -54.56,43.28 -54.56,40.69 J1.4 -54.56,40.54 -54.56,32.61 | -53.34,44.5 -54.56,43.28 | -54.56,43.28 -62.18,43.28 | -62.18,45.72 J2.1 | v-37.19,29.26 -37.19,33.38 S2.2 | U5.4 -22.25,23.47 -22.25,24.38 -23.47,25.6 -31.24,25.6 -32.61,24.23 JP2.1 | -54.56,32.61 -52.58,32.61 -52.12,32.16 | -54.56,32.61 -56.54,32.61 -56.84,32.31 -56.84,32.16 -57.15,31.85 U6.2 | -52.12,32.16 -52.12,31.85 U7.2 -52.12,32.16 | U4.6 -39.17,22.71 -39.17,22.1 -40.39,20.88 -41.91,20.88 -42.67,21.64 -42.67,24.23 -41.45,25.45 -40.39,25.45 -39.78,26.06 -39.78,28.04 U4.16 -39.78,28.19 v-39.78,29.26 -39.78,31.85 -41.3,33.38 S2.1 -41.45,33.53 -43.59,33.53 S3.2 -43.74,33.53 -47.7,33.53 S3.1 -47.85,33.38 -50.9,33.38 -52.12,32.16 | v-52.27,58.98 -53.65,58.98 -54.1,58.52 -59.44,58.52 -60.2,57.76
  Bottom 0.152: v-13.87,48.31 -13.87,45.72 J2.20 | v-42.98,65.68 -48.31,65.68 v-48.46,65.84 | v-36.88,58.22 -38.1,58.22 v-39.62,59.74 -40.39,60.5 -40.84,60.5 -44.35,64.01 -44.96,64.01 -45.26,63.7 v-47.55,63.7 v-52.27,58.98 | JP2.1 -32.61,24.23 -37.19,28.8 v-37.19,29.26 v-39.78,29.26
LNA_IN  (via drill 0.35)
  Top 0.152: v-20.57,34.29 -20.57,29.11 -19.96,28.5 -19.51,28.5 U8.2 | v-32.77,53.03 -32.77,53.34 -31.39,54.71 -31.39,57.15 C8.1 | v-52.88,65.99 -54.1,64.77 L1.1 | v-34.75,65.84 -34.29,65.38 -34.29,63.25 -34.59,62.94 v-37.03,62.94
  Bottom 0.152: v-20.57,34.29 -20.57,35.36 -25.3,40.08 -25.3,42.67 -25.15,42.82 -25.15,44.96 -25.45,45.26 -25.45,46.18 -32.31,53.03 v-32.77,53.03 -33.53,53.8 -33.53,59.13 -37.03,62.64 v-37.03,62.94 | v-52.88,65.99 -50.29,65.99 -49.53,66.75 -35.66,66.75 v-34.75,65.84
N$1
  Top 0.152: R1.1 -16.15,50.9 -14.33,50.9 R1.2
N$7  (via drill 0.35)
  Top 0.152: v-20.27,63.09 -21.95,64.77 R13.2 | v-37.19,24.23 -37.19,28.04 U4.12
  Bottom 0.152: v-20.27,63.09 -19.66,63.09 -8.53,51.97 -8.53,24.38 -12.8,20.12 -33.98,20.12 -37.19,23.32 v-37.19,24.23
N$8  (via drill 0.35)
  Top 0.152: v-23.47,62.18 -23.47,62.48 -25.76,64.77 R14.2 | v-33.68,20.73 -33.68,22.1 -36.42,24.84 -36.42,28.04 U4.11
  Bottom 0.152: v-23.47,62.18 -19.66,62.18 -11.73,54.25 -11.73,51.21 -10.06,49.53 -10.06,28.04 -10.67,27.43 -10.67,22.71 -12.65,20.73 v-33.68,20.73
N$9
  Top 0.152: D1.C -38.1,65.68 -40.23,65.68 -41.6,67.06 -66.29,67.06 -72.85,60.5 -72.85,44.65 -65.68,37.49 -61.11,37.49 -58.37,40.23 -58.37,41.15 -57.61,41.91 -56.69,41.91 -55.93,41.15 -55.93,35.81 -57.45,34.29 -57.45,32.61 -58.22,31.85 U6.1
N$10  (via drill 0.35)
  Top 0.152: Q2.5 -68.58,47.55 -67.36,46.33 -67.36,44.81 -67.67,44.5 -69.34,44.5 -71.93,47.09 v-71.93,53.8 | v-23.16,66.9 -27.43,66.9 -29.57,64.77 R17.2
  Bottom 0.152: v-71.93,53.8 -71.93,62.48 -64.62,69.8 -26.06,69.8 v-23.16,66.9
N$11  (via drill 0.35)
  Top 0.152: v-61.72,58.22 -61.72,57.15 C17.1 | SJ3.2 -57.15,63.86 | -57.15,63.86 v-57.15,62.79 | v-25.76,48.31 -30.94,48.31 -32.92,46.33 -32.92,45.11 -32.31,44.5 -31.39,44.5 -28.04,41.15 -28.04,35.81 -26.06,33.83 -26.06,30.02 U5.8 | v-31.55,63.55 -32.16,64.16 -32.16,66.14 v-32,66.29 | v-62.48,65.53 -61.72,65.53 -60.05,63.86 -57.15,63.86
  Bottom 0.152: v-57.15,62.79 v-61.72,58.22 | v-25.76,48.31 -25.76,57.76 v-31.55,63.55 | v-32,66.29 -32.92,66.29 -34.9,68.28 -60.66,68.28 -61.87,67.06 -61.87,66.14 v-62.48,65.53
N$12  (via drill 0.35)
  Top 0.152: Q2.2 -68.58,46.33 -70.41,48.16 v-70.41,50.9 | v-60.35,67.67 -51.82,67.67 -51.21,68.28 -36.27,68.28 -33.53,65.53 -33.53,64.77 R18.2
  Bottom 0.152: v-70.41,50.9 -70.41,51.97 -69.49,52.88 -69.49,55.47 -69.8,55.78 -69.8,57.15 -64.16,62.79 -62.48,62.79 -61.87,63.4 -61.87,65.68 -60.35,67.21 v-60.35,67.67
N$13  (via drill 0.35)
  Top 0.152: v-17.98,31.7 -17.53,31.24 -17.53,29.72 U8.45 | v-15.24,42.82 v-15.24,37.95 | v-18.75,55.47 v-18.75,53.19 | v-14.48,56.08 -14.48,57.15 C3.2 -14.33,57.15 -12.95,58.52 v-12.95,60.35 | v-49.99,53.19 -49.99,50.6 -49.68,50.29 -46.79,50.29 -46.02,51.05 -45.72,51.05 Y1.1
  Bottom 0.152: v-17.98,31.7 -17.98,35.2 v-15.24,37.95 | v-15.24,42.82 -15.24,43.43 -14.94,43.74 -14.94,44.96 -15.24,45.26 -15.24,49.68 v-18.75,53.19 | v-18.75,55.47 -15.09,55.47 v-14.48,56.08 | v-49.99,53.19 -65.08,53.19 -68.58,49.68 -68.58,43.59 -57.45,32.46 -53.34,32.46 -45.41,24.54 -41.76,24.54 -36.73,19.51 -12.95,19.51 -8.23,24.23 -8.23,55.63 v-12.95,60.35
N$14  (via drill 0.35)  (1 unrouted)
  Top 0.152: v-57.91,30.48 -58.06,30.48 -58.67,31.09 -58.67,32.46 -58.22,32.92 -58.22,34.29 U6.5
  Bottom 0.152: v-57.91,30.48 -57.91,32 -69.19,43.28 -69.19,51.05 -62.33,57.91 -62.33,58.52 -61.87,58.98 -61.57,58.98 -59.74,60.81 R5.2
N$15  (via drill 0.35)  (1 unrouted)
  Top 0.152: v-42.06,47.55 -40.69,46.18 -40.69,45.26 -39.93,44.5 -36.27,44.5 -35.66,45.11 -35.66,46.02 -32.77,48.92 -25.45,48.92 -24.99,48.46 -22.55,48.46 -18.14,52.88 -18.14,57.15 C4.2 | v-42.06,51.82 -43.13,52.88 Y1.3
  Bottom 0.152: v-42.06,51.82 v-42.06,47.55
N$16  (1 unrouted)
N$17  (via drill 0.35)
  Top 0.152: v-39.78,64.01 -38.1,64.01 D1.A | v-56.08,62.33 -56.08,61.11 -56.24,60.96 R4.2
  Bottom 0.152: v-39.78,64.01 -43.43,64.01 -44.04,64.62 -53.49,64.62 -55.78,62.33 v-56.08,62.33
N$18  (via drill 0.35)
  Top 0.152: v-44.65,63.4 -44.2,63.86 -41.91,63.86 D3.A | v-48.31,62.03 -49.07,62.03 -49.53,61.57 -49.53,60.35 -48.31,59.13 v-48.31,58.98 | v-43.28,48.46 -44.65,48.46 v-45.41,47.7 | v-53.34,46.63 -53.8,46.63 -54.1,46.94 -61.57,46.94 -65.99,51.36 v-65.99,56.08 | v-66.9,58.67 -66.9,60.2 -67.67,60.96 R8.2
  Bottom 0.152: v-44.65,63.4 -46.94,63.4 v-48.31,62.03 | v-48.31,58.98 -45.72,58.98 -41,54.25 -37.49,54.25 -37.19,53.95 -37.19,53.34 -38.1,52.43 -42.37,52.43 -43.28,51.51 v-43.28,48.46 | v-45.41,47.7 -52.27,47.7 v-53.34,46.63 | v-65.99,56.08 -65.99,57.76 v-66.9,58.67
N$19  (1 unrouted)
N$20
  Top 0.152: D4.C -45.72,65.68 -43.89,65.68 -43.13,66.45 -41.45,66.45 -40.39,65.38 -40.39,64.31 -40.54,64.16 -40.54,63.55 -39.32,62.33 -29.11,62.33 -28.65,62.79 -28.65,65.08 -27.28,66.45 -23.62,66.45 -23.47,66.29 -21.49,66.29 -21.34,66.45 -15.85,66.45 -14.48,65.08 -14.48,64.77 R9.2
N$21  (via drill 0.35)
  Top 0.152: v-18.29,30.79 -18.29,29.72 U8.47 | v-40.69,59.89 -40.69,60.66 -41,60.96 C27.2 | v-54.1,62.03 -54.1,60.96 R3.1
  Bottom 0.152: v-18.29,30.79 -18.59,30.79 -28.04,40.23 -28.04,41.15 -31.39,44.5 -32.31,44.5 -33.07,45.26 -33.07,48.31 -35.36,50.6 -35.36,53.8 -36.27,54.71 -36.27,55.47 v-40.69,59.89 -41.15,60.35 -50.14,60.35 -50.44,60.05 -50.44,59.89 -51.97,58.37 -52.58,58.37 -54.1,59.89 v-54.1,62.03
RTS  (via drill 0.35)
  Top 0.152: v-67.06,40.23 -67.06,46.48 -67.82,47.24 -67.82,47.85 Q2.4 | v-41.6,21.49 -41.6,22.71 U4.2 | v-34.9,63.55 -35.05,63.7 -35.05,64.77 R18.1 | v-33.22,63.55 -32.61,64.16 -32.61,67.36 -34.44,69.19 v-62.64,69.19
  Bottom 0.152: v-41.6,21.49 -49.84,21.49 -67.06,38.71 v-67.06,40.23 -69.49,42.67 -69.49,46.48 -71.02,48.01 -71.02,60.35 -62.64,68.73 v-62.64,69.19 | v-33.22,63.55 v-34.9,63.55
SHIELD
  Top 0.152: JP15.SHIELD2 -16.46,1.52 -16.46,5.03 JP15.SHIELD3 -16.46,5.18 -16.46,8.69 JP15.SHIELD1
TRACE_ANT  (via drill 0.35)
  Top 0.152: v-44.04,58.52 -46.48,60.96 C28.1 | v-37.19,55.02 -35.81,55.02 -34.29,56.54 -34.29,57.91 -33.38,58.83 -31.39,58.83 -29.72,57.15 C8.2 | v-41.15,47.85 -41.45,47.85 -41.76,48.16 -42.37,48.16 -43.13,47.4 -43.13,38.56 v-42.52,37.95 | v-43.13,25.15 -43.13,9.14 -36.88,2.9 E1.ANT
  Bottom 0.152: v-44.04,58.52 -40.69,58.52 v-37.19,55.02 -37.19,54.41 -36.88,54.1 -36.88,53.19 -40.69,49.38 -41.15,49.38 -41.45,49.07 -41.45,48.16 v-41.15,47.85 | v-42.52,37.95 -42.52,36.27 -43.13,35.66 v-43.13,25.15
U0RXD  (via drill 0.35)
  Top 0.152: v-18.14,37.49 -15.54,34.9 -15.54,29.72 U8.40 | v-40.69,26.06 -42.22,27.58 -42.22,28.04 U4.20 | v-11.28,29.87 -11.28,32.46 v-17.22,38.41
  Bottom 0.152: v-18.14,37.49 -17.53,38.1 -17.53,38.41 | -17.53,38.41 -17.53,39.93 -17.83,40.23 -17.83,41.45 -21.49,45.11 -21.49,45.72 J2.17 | v-40.69,26.06 -34.9,26.06 -33.83,24.99 -33.83,23.62 -32,21.79 -17.22,21.79 -14.63,24.38 -12.8,24.38 -10.97,26.21 -10.97,29.57 v-11.28,29.87 | -17.53,38.41 v-17.22,38.41
U0TXD  (via drill 0.35)  (1 unrouted)
  Top 0.152: v-10.67,49.23 -8.38,46.94 -8.38,26.82 -15.24,19.96 -33.83,19.96 -34.29,20.42 -34.29,21.64 -36.27,23.62 -39.93,23.62 -40.23,23.32 -40.23,22.86 U4.4 | v-13.72,52.27 -13.41,51.97 -13.41,49.84 -14.33,48.92 -18.29,48.92 -19.66,47.55 -19.66,46.33 J2.18
  Bottom 0.152: v-13.72,52.27 v-10.67,49.23
V_BATT  (via drill 0.35)
  Top 0.152: J1.3 -57.15,40.23 -58.98,38.41 -58.98,30.63 -58.22,29.87 -57.61,29.87 -56.24,31.24 -56.24,31.7 U6.3 | v-47.85,52.12 -48.16,52.43 -48.16,53.03 Q1.3 | v-36.88,49.99 -34.75,49.99 -27.58,57.15 C6.1
  Bottom 0.152: v-47.85,52.12 -42.67,46.94 -41.45,46.94 -40.69,46.18 | -40.69,46.18 -40.69,45.26 -41.45,44.5 | -41.45,44.5 -42.37,44.5 -43.28,45.41 -43.28,46.48 -45.11,48.31 -54.56,48.31 J2.3 | -40.69,46.18 v-36.88,49.99 | -40.54,40.08 -40.69,40.23 -40.69,43.74 -41.45,44.5 | -40.54,40.08 -40.08,39.62 -40.08,38.86 -30.79,29.57 -30.79,24.23 JP2.2 | -40.54,40.08 -42.06,38.56 -54.25,38.56 -56.24,40.54 -57.15,40.54 J1.3
V_USB  (via drill 0.35)
  Top 0.152: Q1.1 -49.23,51.21 -49.23,54.1 -51.66,56.54 -51.66,57.76 -51.82,57.91 -53.34,57.91 -54.1,57.15 C14.1 -54.25,57.15 -55.02,57.91 -57,57.91 -57.15,57.76 -57.15,56.54 -56.69,56.08 v-56.24,56.08 -54.25,56.08 -51.36,53.19 -51.36,51.05 -49.99,49.68 -40.84,49.68 -38.56,51.97 -38.1,51.97 F1.2 | v-50.29,34.29 -40.84,34.29 -39.17,32.61 -39.17,28.19 U4.15 | v-55.32,34.59 -55.93,34.59 -56.08,34.44 U6.4 | -69.49,57.15 -69.49,59.59 -70.26,60.35 -70.26,61.57 -65.84,65.99 -64.16,65.99 -63.55,65.38 -63.55,62.03 | -63.55,62.03 -63.55,61.27 -63.86,60.96 R7.2 | v-57.3,55.32 -57.3,52.12 D2.A | v-57.3,59.59 -57.3,60.05 -57.91,60.66 -57.91,60.96 R4.1 -58.06,60.96 -59.13,62.03 -63.55,62.03 | v-52.58,62.64 -50.44,64.77 C15.1 | v-62.18,38.1 -65.84,38.1 -72.54,44.81 -72.54,54.1 -69.49,57.15 | -69.49,57.15 C19.1
  Bottom 0.152: v-50.29,34.29 -53.34,34.29 -53.65,34.59 v-55.32,34.59 -58.67,34.59 v-62.18,38.1 | -57.3,56.08 v-57.3,59.59 -57.3,59.74 -54.41,62.64 v-52.58,62.64 | -57.3,56.08 v-57.3,55.32 | -57.3,56.08 v-56.24,56.08
VIN  (via drill 0.35)
  Top 0.152: U7.3 -51.21,31.7 -51.21,31.24 -51.66,30.79 -52.43,30.79 -52.88,31.24 -52.88,31.7 U7.1 -53.03,31.85 v-55.32,31.85 | -60.96,53.03 -60.05,52.12 -59.59,52.12 D2.C | -60.96,53.03 -62.18,53.03 -62.33,52.88 | -62.33,52.88 -63.09,52.12 C7.1 | -60.96,53.03 -59.28,54.71 -59.28,57.3 -58.37,58.22 -51.66,58.22 -51.36,57.91 -51.36,56.69 -48.92,54.25 -48.92,52.27 -47.85,51.21 -47.4,51.21 Q1.2 | -62.33,52.88 v-63.25,53.8
  Bottom 0.152: v-55.32,31.85 -57.3,31.85 -68.89,43.43 -68.89,49.84 -64.92,53.8 v-63.25,53.8
VUSB-RAW  (via drill 0.35)  (1 unrouted)
  Top 0.152: -40.69,53.95 -38.1,56.54 -38.1,57.91 -37.19,58.83 -35.81,58.83 -34.29,60.35 -34.29,61.57 -34.44,61.72 -37.95,61.72 -38.1,61.57 -38.1,60.35 -39.78,58.67 -39.78,57 -40.39,56.39 -41.91,56.39 -42.67,57.15 C11.1 | -40.69,53.95 -40.69,52.12 F1.1 | v-55.63,50.9 v-55.63,49.68 | v-46.94,55.17 -46.94,54.86 -46.02,53.95 -40.69,53.95
  Bottom 0.152: -59.59,45.72 -59.59,40.69 J1.2 | v-55.63,49.68 -59.59,45.72 | v-55.63,50.9 -52.58,50.9 -50.9,52.58 -49.53,52.58 v-46.94,55.17 | -59.59,45.72 J2.2